# Altium project mb1191.PrjPCB (part 1 of 3)
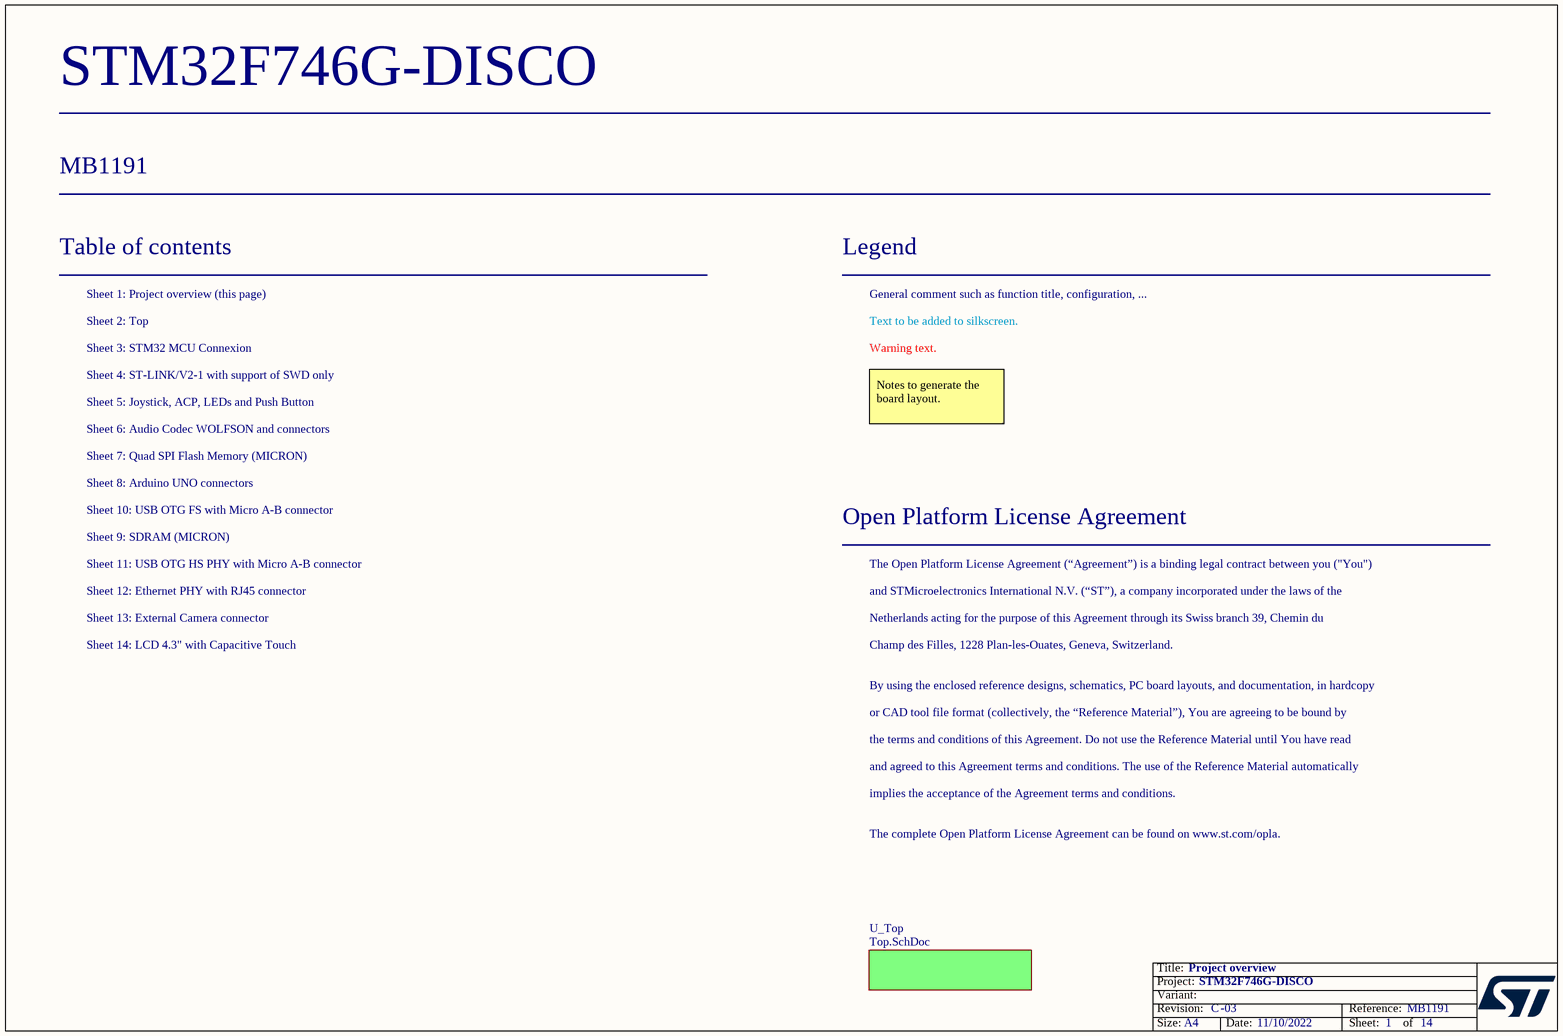
[diagram p0: Project_Overview.SchDoc]
Board_Reference: MB1191; Board_PCB_Revision: C; Board_Name: STM32F746G-DISCO; Board_Document_Date: 11/10/2022; Board_Assembly_Revision: 03
14 sheets, 358 parts. Net scope: flat (ports and power ports of the same name join across sheets).
Board file: MB1191.PcbDoc
Sheets:
  Project_Overview.SchDoc
    U_Top = Top.SchDoc
      U_ST_LINK_V2-1 = ST_LINK_V2-1.SCHDOC
      U_AUDIO = AUDIO.SchDoc
      U_USB_OTG_FS = USB_OTG_FS.SchDoc
      U_Peripherals = Peripherals.SchDoc
      U_QSPI = QSPI.SchDoc
      U_LCD-43 = LCD-43.SchDoc
      U_Arduino_ Connectors = Arduino_ Connectors.SchDoc
      U_SDRAM = SDRAM.SchDoc
      U_USB_OTG_HS = USB_OTG_HS.SchDoc
      U_STM32F7 = STM32F7.SchDoc
      U_Ethernet = Ethernet.SchDoc
      Camera-Connectors = Camera-Connectors.SchDoc

## Sheet Project_Overview.SchDoc: Project overview
size A4; Date: Not used; ApprovedBy: Not used; CheckedBy: Not used; Author: Not used; CompanyName: STMicroelectronics; DrawnBy: Not used; Engineer: Not used; Organization: Not used; Address1: Not used; Address2: Not used; Address3: Not used; Address4: Not used; DocumentNumber: MB1191; Revision: Not used; SheetNumber: 1; SheetTotal: 14; CurrentTime: Not used; CurrentDate: Not used; Time: Not used; DocumentFullPathAndName: Not used; DocumentName: Not used; ModifiedDate: Not used; ImagePath: Not used; ProjectName: Not used; Application_BuildNumber: Not used

### Sub-sheets
U_Top = Top.SchDoc: no entries

### Notes on the sheet
- Table of contents
- Sheet 1: Project overview (this page)
- Legend
- General comment such as function title, configuration, ...
- Sheet 2: Top
- Sheet 4: ST-LINK/V2-1 with support of SWD only
- Sheet 3: STM32 MCU Connexion
- Text to be added to silkscreen.
- Warning text.
- Sheet 5: Joystick, ACP, LEDs and Push Button
- Sheet 6: Audio Codec WOLFSON and connectors
- Notes to generate the board layout.
- Sheet 8: Arduino UNO connectors
- Sheet 10: USB OTG FS with Micro A-B connector
- Sheet 7: Quad SPI Flash Memory (MICRON)
- Sheet 9: SDRAM (MICRON)
- Sheet 11: USB OTG HS PHY with Micro A-B connector
- Open Platform License Agreement
- The Open Platform License Agreement (“Agreement”) is a binding legal contract between you ("You")
- Sheet 12: Ethernet PHY with RJ45 connector
- Sheet 13: External Camera connector
- Sheet 14: LCD 4.3" with Capacitive Touch
- and STMicroelectronics International N.V. (“ST”), a company incorporated under the laws of the
- Netherlands acting for the purpose of this Agreement through its Swiss branch 39, Chemin du
- Champ des Filles, 1228 Plan-les-Ouates, Geneva, Switzerland.
- By using the enclosed reference designs, schematics, PC board layouts, and documentation, in hardcopy
- or CAD tool file format (collectively, the “Reference Material”), You are agreeing to be bound by
- the terms and conditions of this Agreement. Do not use the Reference Material until You have read
- and agreed to this Agreement terms and conditions. The use of the Reference Material automatically
- implies the acceptance of the Agreement terms and conditions.
- The complete Open Platform License Agreement can be found on www.st.com/opla.
- Title:
- Project:
- Size:
- Revision:
- Variant:
- A4
- -
- Date:
- Reference:
- Sheet:
- of

## Sheet Top.SchDoc: STM32F7 Discovery Interconnexion
size A4; Date: 25-FEB-2015; Author: A.B; CompanyName: STMicroelectronics; Address1: 12, Rue Jules HOROWITZ; Address2: 38019 Grenoble; Address3: FRANCE; DocumentNumber: MB1191; Revision: B-02; SheetNumber: 2; SheetTotal: 14; Project: STM32F746G-DISCO
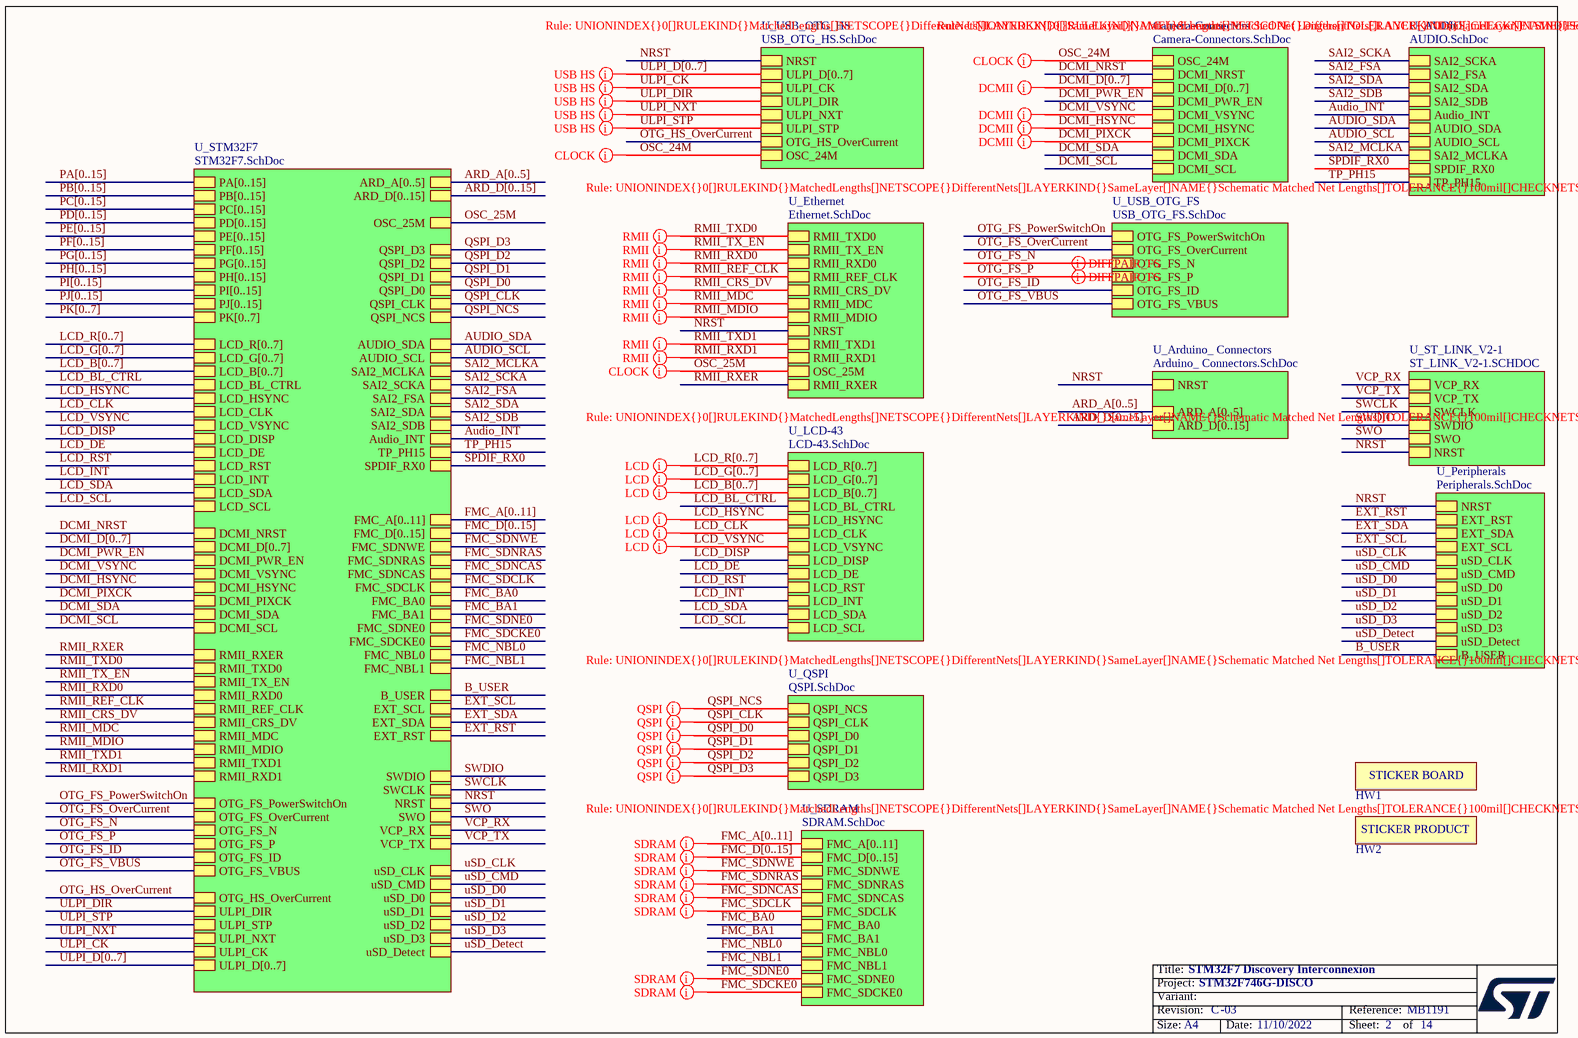
[diagram p1: Top.SchDoc]

### Parts
HW1  STICKER_BOARD  (value not drawn)  (no BOM)
HW2  STICKER_PRODUCT  (value not drawn)  (no BOM)

### Sub-sheets
Camera-Connectors = Camera-Connectors.SchDoc: OSC_24M, DCMI_NRST, DCMI_D[0..7], DCMI_PWR_EN, DCMI_VSYNC, DCMI_HSYNC, DCMI_PIXCK, DCMI_SDA, DCMI_SCL
U_Arduino_ Connectors = Arduino_ Connectors.SchDoc: NRST, ARD_A[0..5], ARD_D[0..15]
U_AUDIO = AUDIO.SchDoc: AUDIO_SDA, AUDIO_SCL, SAI2_MCLKA, SPDIF_RX0, TP_PH15, SAI2_SCKA, SAI2_FSA, SAI2_SDA, SAI2_SDB, Audio_INT
U_Ethernet = Ethernet.SchDoc: RMII_TXD0, RMII_TX_EN, RMII_RXD0, RMII_REF_CLK, RMII_CRS_DV, RMII_MDC, RMII_MDIO, NRST, RMII_TXD1, RMII_RXD1, OSC_25M, RMII_RXER
U_LCD-43 = LCD-43.SchDoc: LCD_R[0..7], LCD_BL_CTRL, LCD_B[0..7], LCD_G[0..7], LCD_HSYNC, LCD_CLK, LCD_VSYNC, LCD_DISP, LCD_DE, LCD_RST, LCD_INT, LCD_SDA, LCD_SCL
U_Peripherals = Peripherals.SchDoc: NRST, EXT_RST, EXT_SCL, EXT_SDA, uSD_CLK, uSD_CMD, uSD_D0, uSD_D1, uSD_D2, uSD_D3, uSD_Detect, B_USER
U_QSPI = QSPI.SchDoc: QSPI_D0, QSPI_D3, QSPI_D1, QSPI_CLK, QSPI_NCS, QSPI_D2
U_SDRAM = SDRAM.SchDoc: FMC_A[0..11], FMC_D[0..15], FMC_SDNWE, FMC_SDNRAS, FMC_SDNCAS, FMC_SDCLK, FMC_BA0, FMC_BA1, FMC_NBL0, FMC_NBL1, FMC_SDNE0, FMC_SDCKE0
U_ST_LINK_V2-1 = ST_LINK_V2-1.SCHDOC: SWDIO, SWCLK, NRST, VCP_RX, VCP_TX, SWO
U_STM32F7 = STM32F7.SchDoc: PA[0..15], PB[0..15], PC[0..15], PD[0..15], PE[0..15], PF[0..15], PG[0..15], PH[0..15], PI[0..15], PJ[0..15], PK[0..7], OSC_25M, LCD_R[0..7], LCD_BL_CTRL, LCD_B[0..7], LCD_G[0..7], LCD_HSYNC, LCD_CLK, LCD_VSYNC, LCD_DISP, LCD_DE, LCD_RST, LCD_INT, LCD_SDA, LCD_SCL, DCMI_NRST, DCMI_D[0..7], DCMI_PWR_EN, DCMI_VSYNC, DCMI_HSYNC, DCMI_PIXCK, DCMI_SDA, DCMI_SCL, RMII_TXD0, RMII_TX_EN, RMII_RXD0, RMII_REF_CLK, RMII_CRS_DV, RMII_MDC, RMII_MDIO, RMII_TXD1, RMII_RXD1, ULPI_D[0..7], ULPI_CK, ULPI_DIR, ULPI_NXT, ULPI_STP, OTG_FS_N, OTG_FS_P, OTG_FS_ID, OTG_FS_VBUS, OTG_FS_PowerSwitchOn, OTG_FS_OverCurrent, QSPI_D0, QSPI_D3, QSPI_D1, QSPI_CLK, QSPI_NCS, AUDIO_SDA, AUDIO_SCL, SAI2_MCLKA, EXT_SCL, EXT_SDA, EXT_RST, uSD_CLK, uSD_CMD, uSD_D0, uSD_D1, uSD_D2, uSD_D3, uSD_Detect, SWDIO, SWCLK, NRST, SWO, VCP_RX, VCP_TX, FMC_A[0..11], FMC_D[0..15], FMC_SDNWE, FMC_SDNRAS, FMC_SDNCAS, FMC_SDCLK, FMC_BA0, FMC_BA1, FMC_SDNE0, FMC_SDCKE0, FMC_NBL0, FMC_NBL1, SPDIF_RX0, QSPI_D2, B_USER, ARD_A[0..5], ARD_D[0..15], RMII_RXER, OTG_HS_OverCurrent, SAI2_SCKA, SAI2_FSA, SAI2_SDA, SAI2_SDB, Audio_INT, TP_PH15
U_USB_OTG_FS = USB_OTG_FS.SchDoc: OTG_FS_PowerSwitchOn, OTG_FS_OverCurrent, OTG_FS_N, OTG_FS_P, OTG_FS_ID, OTG_FS_VBUS
U_USB_OTG_HS = USB_OTG_HS.SchDoc: ULPI_D[0..7], ULPI_CK, ULPI_DIR, ULPI_NXT, ULPI_STP, OSC_24M, NRST, OTG_HS_OverCurrent

### Nets
Audio_INT: sheet U_AUDIO/Audio_INT, sheet U_STM32F7/Audio_INT
AUDIO_SCL: sheet U_AUDIO/AUDIO_SCL, sheet U_STM32F7/AUDIO_SCL
AUDIO_SDA: sheet U_AUDIO/AUDIO_SDA, sheet U_STM32F7/AUDIO_SDA
B_USER: sheet U_Peripherals/B_USER, sheet U_STM32F7/B_USER
DCMI_HSYNC: sheet U_STM32F7/DCMI_HSYNC, sheet Camera-Connectors/DCMI_HSYNC
DCMI_NRST: sheet U_STM32F7/DCMI_NRST, sheet Camera-Connectors/DCMI_NRST
DCMI_PIXCK: sheet U_STM32F7/DCMI_PIXCK, sheet Camera-Connectors/DCMI_PIXCK
DCMI_PWR_EN: sheet U_STM32F7/DCMI_PWR_EN, sheet Camera-Connectors/DCMI_PWR_EN
DCMI_SCL: sheet U_STM32F7/DCMI_SCL, sheet Camera-Connectors/DCMI_SCL
DCMI_SDA: sheet U_STM32F7/DCMI_SDA, sheet Camera-Connectors/DCMI_SDA
DCMI_VSYNC: sheet U_STM32F7/DCMI_VSYNC, sheet Camera-Connectors/DCMI_VSYNC
EXT_RST: sheet U_Peripherals/EXT_RST, sheet U_STM32F7/EXT_RST
EXT_SCL: sheet U_Peripherals/EXT_SCL, sheet U_STM32F7/EXT_SCL
EXT_SDA: sheet U_Peripherals/EXT_SDA, sheet U_STM32F7/EXT_SDA
FMC_BA0: sheet U_SDRAM/FMC_BA0, sheet U_STM32F7/FMC_BA0
FMC_BA1: sheet U_SDRAM/FMC_BA1, sheet U_STM32F7/FMC_BA1
FMC_NBL0: sheet U_SDRAM/FMC_NBL0, sheet U_STM32F7/FMC_NBL0
FMC_NBL1: sheet U_SDRAM/FMC_NBL1, sheet U_STM32F7/FMC_NBL1
FMC_SDCKE0: sheet U_SDRAM/FMC_SDCKE0, sheet U_STM32F7/FMC_SDCKE0
FMC_SDCLK: sheet U_SDRAM/FMC_SDCLK, sheet U_STM32F7/FMC_SDCLK
FMC_SDNCAS: sheet U_SDRAM/FMC_SDNCAS, sheet U_STM32F7/FMC_SDNCAS
FMC_SDNE0: sheet U_SDRAM/FMC_SDNE0, sheet U_STM32F7/FMC_SDNE0
FMC_SDNRAS: sheet U_SDRAM/FMC_SDNRAS, sheet U_STM32F7/FMC_SDNRAS
FMC_SDNWE: sheet U_SDRAM/FMC_SDNWE, sheet U_STM32F7/FMC_SDNWE
LCD_BL_CTRL: sheet U_LCD-43/LCD_BL_CTRL, sheet U_STM32F7/LCD_BL_CTRL
LCD_CLK: sheet U_LCD-43/LCD_CLK, sheet U_STM32F7/LCD_CLK
LCD_DE: sheet U_LCD-43/LCD_DE, sheet U_STM32F7/LCD_DE
LCD_DISP: sheet U_LCD-43/LCD_DISP, sheet U_STM32F7/LCD_DISP
LCD_HSYNC: sheet U_LCD-43/LCD_HSYNC, sheet U_STM32F7/LCD_HSYNC
LCD_INT: sheet U_LCD-43/LCD_INT, sheet U_STM32F7/LCD_INT
LCD_RST: sheet U_LCD-43/LCD_RST, sheet U_STM32F7/LCD_RST
LCD_SCL: sheet U_LCD-43/LCD_SCL, sheet U_STM32F7/LCD_SCL
LCD_SDA: sheet U_LCD-43/LCD_SDA, sheet U_STM32F7/LCD_SDA
LCD_VSYNC: sheet U_LCD-43/LCD_VSYNC, sheet U_STM32F7/LCD_VSYNC
NRST: sheet U_ST_LINK_V2-1/NRST, sheet U_Peripherals/NRST, sheet U_Arduino_ Connectors/NRST, sheet U_USB_OTG_HS/NRST, sheet U_STM32F7/NRST, sheet U_Ethernet/NRST
OSC_24M: sheet U_USB_OTG_HS/OSC_24M, sheet Camera-Connectors/OSC_24M
OSC_25M: sheet U_STM32F7/OSC_25M, sheet U_Ethernet/OSC_25M
OTG_FS_ID: sheet U_USB_OTG_FS/OTG_FS_ID, sheet U_STM32F7/OTG_FS_ID
OTG_FS_N: sheet U_USB_OTG_FS/OTG_FS_N, sheet U_STM32F7/OTG_FS_N
OTG_FS_OverCurrent: sheet U_USB_OTG_FS/OTG_FS_OverCurrent, sheet U_STM32F7/OTG_FS_OverCurrent
OTG_FS_P: sheet U_USB_OTG_FS/OTG_FS_P, sheet U_STM32F7/OTG_FS_P
OTG_FS_PowerSwitchOn: sheet U_USB_OTG_FS/OTG_FS_PowerSwitchOn, sheet U_STM32F7/OTG_FS_PowerSwitchOn
OTG_FS_VBUS: sheet U_USB_OTG_FS/OTG_FS_VBUS, sheet U_STM32F7/OTG_FS_VBUS
OTG_HS_OverCurrent: sheet U_USB_OTG_HS/OTG_HS_OverCurrent, sheet U_STM32F7/OTG_HS_OverCurrent
QSPI_CLK: sheet U_QSPI/QSPI_CLK, sheet U_STM32F7/QSPI_CLK
QSPI_D0: sheet U_QSPI/QSPI_D0, sheet U_STM32F7/QSPI_D0
QSPI_D1: sheet U_QSPI/QSPI_D1, sheet U_STM32F7/QSPI_D1
QSPI_D2: sheet U_QSPI/QSPI_D2, sheet U_STM32F7/QSPI_D2
QSPI_D3: sheet U_QSPI/QSPI_D3, sheet U_STM32F7/QSPI_D3
QSPI_NCS: sheet U_QSPI/QSPI_NCS, sheet U_STM32F7/QSPI_NCS
RMII_CRS_DV: sheet U_STM32F7/RMII_CRS_DV, sheet U_Ethernet/RMII_CRS_DV
RMII_MDC: sheet U_STM32F7/RMII_MDC, sheet U_Ethernet/RMII_MDC
RMII_MDIO: sheet U_STM32F7/RMII_MDIO, sheet U_Ethernet/RMII_MDIO
RMII_REF_CLK: sheet U_STM32F7/RMII_REF_CLK, sheet U_Ethernet/RMII_REF_CLK
RMII_RXD0: sheet U_STM32F7/RMII_RXD0, sheet U_Ethernet/RMII_RXD0
RMII_RXD1: sheet U_STM32F7/RMII_RXD1, sheet U_Ethernet/RMII_RXD1
RMII_RXER: sheet U_STM32F7/RMII_RXER, sheet U_Ethernet/RMII_RXER
RMII_TX_EN: sheet U_STM32F7/RMII_TX_EN, sheet U_Ethernet/RMII_TX_EN
RMII_TXD0: sheet U_STM32F7/RMII_TXD0, sheet U_Ethernet/RMII_TXD0
RMII_TXD1: sheet U_STM32F7/RMII_TXD1, sheet U_Ethernet/RMII_TXD1
SAI2_FSA: sheet U_AUDIO/SAI2_FSA, sheet U_STM32F7/SAI2_FSA
SAI2_MCLKA: sheet U_AUDIO/SAI2_MCLKA, sheet U_STM32F7/SAI2_MCLKA
SAI2_SCKA: sheet U_AUDIO/SAI2_SCKA, sheet U_STM32F7/SAI2_SCKA
SAI2_SDA: sheet U_AUDIO/SAI2_SDA, sheet U_STM32F7/SAI2_SDA
SAI2_SDB: sheet U_AUDIO/SAI2_SDB, sheet U_STM32F7/SAI2_SDB
SPDIF_RX0: sheet U_AUDIO/SPDIF_RX0, sheet U_STM32F7/SPDIF_RX0
SWCLK: sheet U_ST_LINK_V2-1/SWCLK, sheet U_STM32F7/SWCLK
SWDIO: sheet U_ST_LINK_V2-1/SWDIO, sheet U_STM32F7/SWDIO
SWO: sheet U_ST_LINK_V2-1/SWO, sheet U_STM32F7/SWO
TP_PH15: sheet U_AUDIO/TP_PH15, sheet U_STM32F7/TP_PH15
ULPI_CK: sheet U_USB_OTG_HS/ULPI_CK, sheet U_STM32F7/ULPI_CK
ULPI_DIR: sheet U_USB_OTG_HS/ULPI_DIR, sheet U_STM32F7/ULPI_DIR
ULPI_NXT: sheet U_USB_OTG_HS/ULPI_NXT, sheet U_STM32F7/ULPI_NXT
ULPI_STP: sheet U_USB_OTG_HS/ULPI_STP, sheet U_STM32F7/ULPI_STP
uSD_CLK: sheet U_Peripherals/uSD_CLK, sheet U_STM32F7/uSD_CLK
uSD_CMD: sheet U_Peripherals/uSD_CMD, sheet U_STM32F7/uSD_CMD
uSD_D0: sheet U_Peripherals/uSD_D0, sheet U_STM32F7/uSD_D0
uSD_D1: sheet U_Peripherals/uSD_D1, sheet U_STM32F7/uSD_D1
uSD_D2: sheet U_Peripherals/uSD_D2, sheet U_STM32F7/uSD_D2
uSD_D3: sheet U_Peripherals/uSD_D3, sheet U_STM32F7/uSD_D3
uSD_Detect: sheet U_Peripherals/uSD_Detect, sheet U_STM32F7/uSD_Detect
VCP_RX: sheet U_ST_LINK_V2-1/VCP_RX, sheet U_STM32F7/VCP_RX
VCP_TX: sheet U_ST_LINK_V2-1/VCP_TX, sheet U_STM32F7/VCP_TX

### Buses and harness runs
bus ARD_A[0..5] = sheet U_Arduino_ Connectors/ARD_A[0..5]
bus ARD_A[0..5] = sheet U_STM32F7/ARD_A[0..5]
bus ARD_D[0..15] = sheet U_Arduino_ Connectors/ARD_D[0..15]
bus ARD_D[0..15] = sheet U_STM32F7/ARD_D[0..15]
bus DCMI_D[0..7] = sheet Camera-Connectors/DCMI_D[0..7]
bus DCMI_D[0..7] = sheet U_STM32F7/DCMI_D[0..7]
bus FMC_A[0..11] = sheet U_SDRAM/FMC_A[0..11]
bus FMC_A[0..11] = sheet U_STM32F7/FMC_A[0..11]
bus FMC_D[0..15] = sheet U_SDRAM/FMC_D[0..15]
bus FMC_D[0..15] = sheet U_STM32F7/FMC_D[0..15]
bus LCD_B[0..7] = sheet U_LCD-43/LCD_B[0..7]
bus LCD_B[0..7] = sheet U_STM32F7/LCD_B[0..7]
bus LCD_G[0..7] = sheet U_LCD-43/LCD_G[0..7]
bus LCD_G[0..7] = sheet U_STM32F7/LCD_G[0..7]
bus LCD_R[0..7] = sheet U_LCD-43/LCD_R[0..7]
bus LCD_R[0..7] = sheet U_STM32F7/LCD_R[0..7]
bus PA[0..15] = sheet U_STM32F7/PA[0..15]
bus PB[0..15] = sheet U_STM32F7/PB[0..15]
bus PC[0..15] = sheet U_STM32F7/PC[0..15]
bus PD[0..15] = sheet U_STM32F7/PD[0..15]
bus PE[0..15] = sheet U_STM32F7/PE[0..15]
bus PF[0..15] = sheet U_STM32F7/PF[0..15]
bus PG[0..15] = sheet U_STM32F7/PG[0..15]
bus PH[0..15] = sheet U_STM32F7/PH[0..15]
bus PI[0..15] = sheet U_STM32F7/PI[0..15]
bus PJ[0..15] = sheet U_STM32F7/PJ[0..15]
bus PK[0..7] = sheet U_STM32F7/PK[0..7]
bus ULPI_D[0..7] = sheet U_STM32F7/ULPI_D[0..7]
bus ULPI_D[0..7] = sheet U_USB_OTG_HS/ULPI_D[0..7]

### Layout directives
rule Matched Net Lengths [Tolerance = 100mil]: (no net found under the mark), DCMI_HSYNC, DCMI_PIXCK, DCMI_VSYNC, FMC_SDCKE0, FMC_SDCLK, FMC_SDNCAS, FMC_SDNE0, FMC_SDNRAS, FMC_SDNWE, LCD_CLK, LCD_HSYNC, LCD_VSYNC, QSPI_CLK, QSPI_D0, QSPI_D1, QSPI_D2, QSPI_D3, QSPI_NCS, RMII_CRS_DV, RMII_MDC, RMII_MDIO, RMII_REF_CLK, RMII_RXD0, RMII_RXD1, RMII_TX_EN, RMII_TXD0, RMII_TXD1, ULPI_CK, ULPI_DIR, ULPI_NXT, ULPI_STP
rule Undefined: OSC_24M, OSC_25M
differential pair: OTG_FS_N, OTG_FS_P

### Notes on the sheet
- Title:
- Project:
- Size:
- Revision:
- Variant:
- A4
- -
- Date:
- Reference:
- Sheet:
- of
- (in symbol STICKER_BOARD) STICKER BOARD
- (in symbol STICKER_PRODUCT) STICKER PRODUCT

## Sheet ST_LINK_V2-1.SCHDOC: ST-LINK/V2-1 with support of SWD only
size A4; Date: 25-FEB-2015; Author: A.B; CompanyName: STMicroelectronics; Address1: 12, Rue Jules HOROWITZ; Address2: 38019 Grenoble; Address3: FRANCE; DocumentNumber: MB1191; Revision: B-02; SheetNumber: 4; SheetTotal: 14; Project: STM32F746G-DISCO
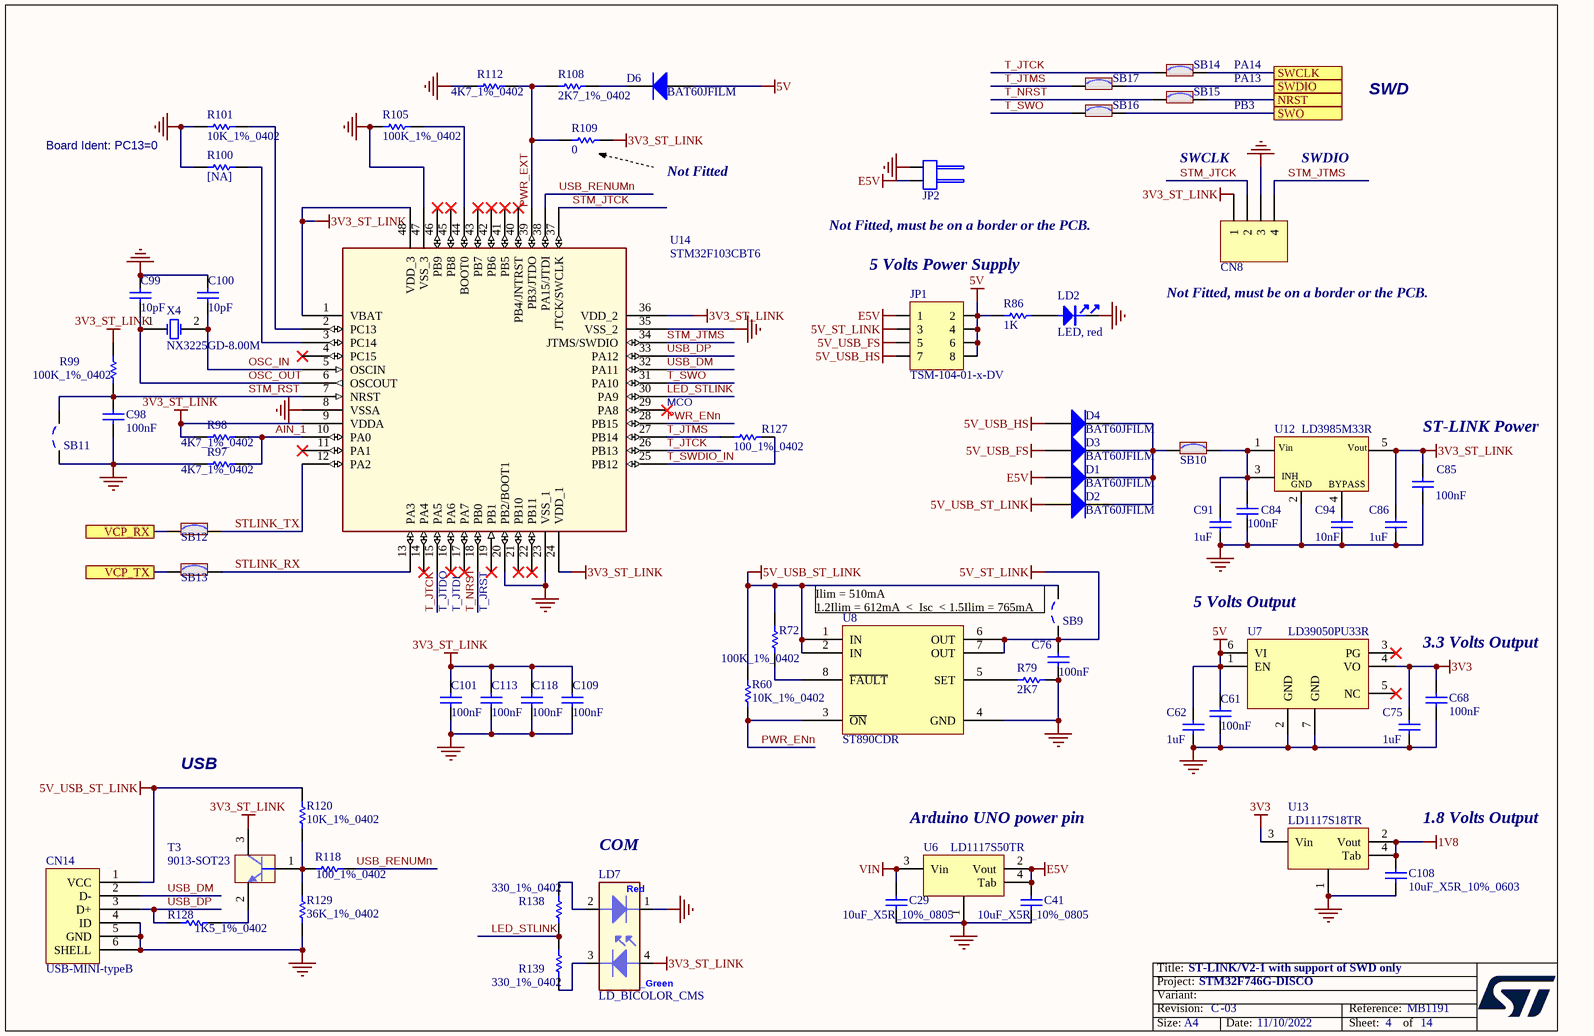
[diagram p2: ST_LINK_V2-1.SCHDOC]

### Parts
C29  10uF_X5R_10%_0805  [0805C]
C41  10uF_X5R_10%_0805  [0805C]
C61  100nF  [0402C]
C62  1uF  [0603C]
C68  100nF  [0402C]
C75  1uF  [0603C]
C76  100nF  [0402C]
C84  100nF  [0402C]
C85  100nF  [0402C]
C86  1uF  [0603C]
C91  1uF  [0603C]
C94  10nF  [0603C]
C98  100nF  [0402C]
C99  10pF  [0402C]
C100  10pF  [0402C]
C101  100nF  [0402C]
C108  10uF_X5R_10%_0603  [0603C]
C109  100nF  [0402C]
C113  100nF  [0402C]
C118  100nF  [0402C]
CN8  Header 4  [Header 4]  (value not drawn)
CN14  USB-MINI-typeB  [USB-MINI-B-SMD]
D1  BAT60JFILM  [SOD323/A]
D2  BAT60JFILM  [SOD323/A]
D3  BAT60JFILM  [SOD323/A]
D4  BAT60JFILM  [SOD323/A]
D6  BAT60JFILM  [SOD323/A]
JP1  TSM-104-01-x-DV  [TSM-104-01-x-DV]
JP2  TSM-102-01-F-SH-A  [TSM-102-01-F-SH-A]  (value not drawn)
LD2  LED, red  [0603D]
LD7  LD_BICOLOR_CMS  [HSMF-A201]
R60  10K_1%_0402  [0402R]
R72  100K_1%_0402  [0402R]
R79  2K7  [0402R]
R86  1K  [0402R]
R97  4K7_1%_0402  [0402R]
R98  4K7_1%_0402  [0402R]
R99  100K_1%_0402  [0402R]
R100  [NA]  [0402R]
R101  10K_1%_0402  [0402R]
R105  100K_1%_0402  [0402R]
R108  2K7_1%_0402  [0402R]
R109  0  [0402R]
R112  4K7_1%_0402  [0402R]
R118  100_1%_0402  [0402R]
R120  10K_1%_0402  [0402R]
R127  100_1%_0402  [0402R]
R128  1K5_1%_0402  [0402R]
R129  36K_1%_0402  [0402R]
R138  330_1%_0402  [0402R]
R139  330_1%_0402  [0402R]
SB9  Solder Bridge OFF  [JP2_SMD]  (value not drawn)
SB10  Solder Bridge ON  [JP2_SMD]  (value not drawn)
SB11  Solder Bridge OFF  [JP2_SMD]  (value not drawn)
SB12  Solder Bridge ON  [JP2_SMD]  (value not drawn)
SB13  Solder Bridge ON  [JP2_SMD]  (value not drawn)
SB14  Solder Bridge ON  [JP2_SMD]  (value not drawn)
SB15  Solder Bridge ON  [JP2_SMD]  (value not drawn)
SB16  Solder Bridge ON  [JP2_SMD]  (value not drawn)
SB17  Solder Bridge ON  [JP2_SMD]  (value not drawn)
T3  9013-SOT23  [SOT23]
U6  LD1117S50TR  [SOT-223]
U7  LD39050PU33R  [DFN6_3x3]
U8  ST890CDR  [SO-8]
U12  LD3985M33R  [SOT23-5L]
U13  LD1117S18TR  [SOT-223]
U14  STM32F103CBT6  [QFP48 7x7]
X4  NX3225GD-8.00M  [XTAL_2SM_3R2X2R5]

### Ports
NRST, SWCLK, SWDIO, SWO, VCP_RX, VCP_TX

### Nets
1V8: C108.2 U13.2(Vout) U13.4(Tab)
3V3: C68.2 C75.2 U7.4(VO) U13.3(Vin)
3V3_ST_LINK: C85.2 C86.1 C101.2 C109.2 C113.2 C118.1 CN8.1 LD7.4 R98.1 R99.2 R109.2 T3.3(C) U12.5(Vout) U14.1(VBAT) U14.9(VDDA) U14.24(VDD_1) U14.36(VDD_2) U14.48(VDD_3)
5V: C61.2 C62.2 D6.1(A) JP1.2 JP1.4 JP1.6 JP1.8 R86.1 U7.1(EN) U7.6(VI)
5V_ST_LINK: C76.2 JP1.3 SB9.1 U8.6(OUT) U8.7(OUT)
5V_USB_FS: D3.1(A) JP1.5
5V_USB_HS: D4.1(A) JP1.7
5V_USB_ST_LINK: CN14.1(VCC) D2.1(A) R60.2 R72.2 R120.2 SB9.2 U8.1(IN) U8.2(IN)
E5V: C41.2 D1.1(A) JP1.1 JP2.2(NO) U6.2(Vout) U6.4(Tab)
GND: C29.1 C41.1 C61.1 C62.1 C68.1 C75.1 C76.1 C84.1 C85.1 C86.2 C91.1 C94.1 C98.1 C99.1 C100.1 C101.1 C108.1 C109.1 C113.1 C118.2 CN8.3 CN14.4(ID) CN14.5(GND) CN14.6(SHELL) JP2.1(COMMON) LD2.2 LD7.1 R79.2 R97.1 R100.1 R101.1 R105.1 R112.1 R129.1 SB11.1 U6.1 U7.2(GND) U7.7(GND) U8.4(GND) U12.2(GND) U13.1 U14.8(VSSA) U14.20(PB2/BOOT1) U14.23(VSS_1) U14.35(VSS_2) U14.47(VSS_3)
VIN: C29.2 U6.3(Vin)
AIN_1: R97.2 R98.2 U14.10(PA0)
DCMI_NRST: SB15.2 ; port NRST
LED_STLINK: R138.1 R139.2 U14.30(PA9)
OSC_IN: C100.2 U14.5(OSCIN) X4.2(OSC2)
OSC_OUT: C99.2 U14.6(OSCOUT) X4.1(OSC1)
PA13: SB17.2 ; port SWDIO
PA14: SB14.2 ; port SWCLK
PB3: SB16.2 ; port SWO
PB7: SB12.1 ; port VCP_RX
PWR_ENn: R60.1 U8.3(~{ON}) U14.28(PB15)
PWR_EXT: R108.1 R109.1 R112.2 U14.39(PB3/JTDO)
STLINK_RX: SB13.2 U14.13(PA3)
STLINK_TX: SB12.2 U14.12(PA2)
STM_JTCK: CN8.2 U14.37(JTCK/SWCLK)
STM_JTMS: CN8.4 U14.34(JTMS/SWDIO)
STM_RST: C98.2 R99.1 SB11.2 U14.7(NRST)
T_JTCK: SB14.1 U14.15(PA5) U14.26(PB13)
T_JTMS: R127.1 SB17.1 U14.27(PB14)
T_NRST: SB15.1 U14.18(PB0)
T_SWDIO_IN: R127.2 U14.25(PB12)
T_SWO: SB16.1 U14.31(PA10)
USB_DM: CN14.2(D-) U14.32(PA11)
USB_DP: CN14.3(D+) R128.1 U14.33(PA12)
USB_RENUMn: R118.2 U14.38(PA15/JTDI)
VCP_TX: SB13.1 ; port VCP_TX
NetC84_2: C84.2 C91.2 SB10.2 U12.1(Vin) U12.3(CE)
NetC94_2: C94.2 U12.4(BYPASS)
NetD1_2: D1.2(K) D2.2(K) D3.2(K) D4.2(K) SB10.1
NetD6_2: D6.2(K) R108.2
NetLD2_1: LD2.1 R86.2
NetLD7_2: LD7.2 R138.2
NetLD7_3: LD7.3 R139.1
NetR72_1: R72.1 U8.8(~{FAULT})
NetR79_1: R79.1 U8.5(SET)
NetR100_2: R100.2 U14.3(PC14)
NetR101_2: R101.2 U14.2(PC13)
NetR105_2: R105.2 U14.44(BOOT0)
NetR118_1: R118.1 R120.1 R129.2 T3.1(B)
NetR128_2: R128.2 T3.2(E)

Not connected (* = marked no-connect by the designer): U7 3(PG)* 5(NC)*; U14 4(PC15)* 11(PA1)* 14(PA4)* 16(PA6)* 17(PA7)* 19(PB1)* 21(PB10)* 22(PB11)* 29(PA8)* 40(PB4/JNTRST)* 41(PB5)* 42(PB6)* 43(PB7)* 45(PB8)* 46(PB9)*

### Notes on the sheet
- PA14
- PA13
- PB3
- SWD
- Board Ident: PC13=0
- Not Fitted
- SWCLK
- SWDIO
- (near JP2) Not Fitted, must be on a border or the PCB.
- 5 Volts Power Supply
- Not Fitted, must be on a border or the PCB.
- MCO
- ST-LINK Power
- (near U14) T_JTDO
- (near U14) T_JTDI
- (near U14) T_JRST
- (near SB9) Ilim = 510mA
  1.2Ilim = 612mA  <  Isc  < 1.5Ilim = 765mA
- 5 Volts Output
- 3.3 Volts Output
- USB
- COM
- (near U6) Arduino UNO power pin
- 1.8 Volts Output
- Title:
- Project:
- Size:
- Revision:
- Variant:
- A4
- -
- Date:
- Reference:
- Sheet:
- of
- (in symbol LD3985M33R) INH
- (in symbol LD_BICOLOR_CMS) Red; _Green

### Library data of the parts
C29 C41 = Cap_10uF_X5R_10%_0805: Capacitor,10uF,25V,X5R,10%,0805,YAGEO; Manuf_Part_1: CC0805KRX5R8BB106; Revision: July-2002: Re-released for DXP Platform.; Value: 10uF; Order: CC0805KRX5R8BB106; Manuf_1: YAGEO; ECCN_US/EU: n/a
C61 C68 C76 C84 C85 C98 C101 C109 C113 C118 = Cap_100nF_X7R_10%_0402: Capacitor,100nF,16V,X7R,10%,0402,YAGEO; Manuf_Part_1: CC0402KRX7R7BB104; Revision: July-2002: Re-released for DXP Platform.; Value: 100nF; Order: CC0402KRX7R7BB104; Manuf_1: YAGEO
C62 C75 C86 C91 = Cap_1uF_X5R_10%_0603: Capacitor,1uF,16V,X5R,10%,0603,YAGEO; Manuf_Part_1: CC0603KRX5R7BB105; Revision: July-2002: Re-released for DXP Platform.; Value: 1uF; Order: CC0603KRX5R7BB105; Manuf_1: YAGEO
C94 = Cap_10nF_X7R_10%_0603: Capacitor,10nF,50V,X7R,10%,0603,YAGEO; Manuf_Part_1: CC0603KRX7R9BB103; Revision: July-2002: Re-released for DXP Platform.; Value: 10nF; Order: CC0603KRX7R9BB103; Manuf_1: YAGEO
C99 C100 = Cap_10pF_NPO_5%_0402: Capacitor,10pF,50V,NPO,5%,0402,YAGEO; Order: CC0402JRNPO9BN100; Revision: July-2002: Re-released for DXP Platform.; Value: 10pF; Manuf_1: YAGEO; Manuf_Part_1: CC0402JRNPO9BN100; ECCN_US/EU: n/a
C108 = Cap_10uF_X5R_10%_0603: Capacitor,10uF,6.3V,X5R,10%,0603,YAGEO; Manuf_Part_1: CC0603KRX5R5BB106; Revision: July-2002: Re-released for DXP Platform.; Value: 10uF; Order: CC0603KRX5R5BB106; Manuf_1: YAGEO; ECCN_US/EU: n/a
CN8 = Header 4: Header, 4-Pin; Fitted: NO; Revision: 17-Jul-2002: Re-released for DXP Platform.; Publisher: Altium Limited; ECCN_US/EU: n/a
CN14 = USB-MINI-typeB connector: Manuf_Part_1: 5075BMR-05-SM; Manuf_Part_2: 218205M1110T; Manuf_2: lyconn; Manuf_Part_3: MUSB5QS-BM1H6-NLB-E; Manuf_3: TOWNES; ECCN_US/EU: n/a
D1-D4 D6 = BAT60JFILM: Manuf_1: STM; Provided: ST; ECCN_US/EU: EAR99/NEC; Ref St: 9151097; Revision: July-2002: Re-released for DXP Platform.; Order: BAT60JFILM; Manuf_Part_1: BAT60JFILM; Distrib: ST
JP1 = Header_4X2_SMD: Header, 4-Pins, Double row Vertical, SMD, 2.54; Manuf_1: SAMTEC; Manuf_Part_1: TSM-104-01-x-DV; ECCN_US/EU: n/a
JP2 = JP2_CMS: Header, 2-Pins, Single row Horizontal SMD, 2.54; Manuf_1: SAMTEC; ECCN_US/EU: EAR99/NEC; Manuf_Part_1: TSM-102-01-F-SH-A
LD2 = LED_red: LED, red, 0603; Manuf_1: everlight; Manuf_Part_1: 19-217/R6C-AL1M2VY/3T; ECCN_US/EU: EAR99/NEC; Order: 19-217/R6C-AL1M2VY/3T
LD7 = LD_BICOLOR_CMS: Bicolor Led; Manuf_Part_1: HSMF-A201-A00J1; Manuf_1: Avago Technologies; Manuf_2: everluck; Manuf_Part_2: LE-RGW35280; Ref St: xxxxxx; ECCN_US/EU: EAR99/NEC; Distrib: RADIOSPARES
R60 R101 R120 = Res_10K_1%_0402: Resistor,10K,0402,1%,YAGEO; Manuf_Part_1: RC0402FR-0710KL; Value: 10K; Manuf_1: YAGEO; Order: RC0402FR-0710KL; ECCN_US/EU: n/a
R72 R99 R105 = Res_100K_1%_0402: Resistor,100K,0402,1%,YAGEO; Manuf_Part_1: RT0402FRE07100KL; Value: 100K; Manuf_1: YAGEO; Order: RT0402FRE07100KL; ECCN_US/EU: n/a
R79 R108 = Res_2K7_1%_0402: Resistor,2K7,0402,1%,YAGEO; Manuf_Part_1: RC0402FR-072K7L; Value: 2K7; Manuf_1: YAGEO; Order: RC0402FR-072K7L; ECCN_US/EU: n/a; Distrib: FARNELL
R86 = Res_1K_1%_0402: Resistor,1K,0402,1%,YAGEO; Manuf_Part_1: RC0402FR-071KL; Value: 1K; Manuf_1: YAGEO; Order: RC0402FR-071KL; ECCN_US/EU: n/a
R97 R98 R112 = Res_4K7_1%_0402: Resistor,4K7,0402,1%,YAGEO; Manuf_Part_1: RT0402FRE074K7L; Value: 4K7; Manuf_1: YAGEO; Order: RT0402FRE074K7L; ECCN_US/EU: n/a
R100 = Res_NA_0402: Resistor,[NA],0402; Fitted: NO; Value: [NA]; ECCN_US/EU: n/a
R109 = Res_0_5%_0402: Resistor,0,0402,5%,YAGEO; Manuf_Part_1: RC0402JR-070RL; Order: 2363467; Fitted: NO; Value: 0; ECCN_US/EU: n/a; Manuf_1: YAGEO; Distrib: FARNELL
R118 R127 = Res_100_1%_0402: Resistor,100,0402,1%,YAGEO; Manuf_Part_1: RC0402FR-07100RL; Value: 100; Order: 9239111; Manuf_1: YAGEO; ECCN_US/EU: n/a; Distrib: FARNELL
R128 = Res_1K5_1%_0402: Resistor,1K5,0402,1%,YAGEO; Manuf_Part_1: RC0402FR-071K5L; Value: 1K5; Manuf_1: YAGEO; Order: RC0402FR-071K5L; ECCN_US/EU: n/a; Distrib: FARNELL
R129 = Res_36K_1%_0402: Resistor,36K,0402,1%,YAGEO; Manuf_Part_1: RC0402FR-0736KL; Value: 36K; Manuf_1: YAGEO; Order: RC0402FR-0736KL; ECCN_US/EU: n/a; Distrib: FARNELL
R138 R139 = Res_330_1%_0402: Resistor,330,0402,1%,YAGEO; Manuf_Part_1: RC0402FR-07330RL; Value: 330; ECCN_US/EU: n/a; Manuf_1: YAGEO; Distrib: DIGIKEY; Order: RC0402FR-07330RL
SB9 SB11 = SB_OFF: Solder: NO; Revision: July-2002: Re-released for DXP Platform.; ECCN_US/EU: n/a
SB10 SB12-SB17 = SB_ON: Solder: YES; Revision: July-2002: Re-released for DXP Platform.; ECCN_US/EU: n/a
T3 = 9013-SOT23: NPN Bipolar Transistor; Manuf_1: NXP; Manuf_Part_1: BSR14; Order: 1081310; ECCN_US/EU: EAR99/NEC; Revision: July-2002: Re-released for DXP Platform.; Distrib: FARNELL
U6 = LD1117S50TR: IC REG LDO 5V 0.8A SOT223; Manuf_1: STM; Ordered by: ST; ECCN_US/EU: EAR99/NEC; Ref St: 9176133; Manuf_Part_1: LD1117S50TR; Distrib: ST; Order: LD1117S50TR; Provided: ST
U7 = LD39050P: Ultra low drop-low , 500 mA low quiescent current; Manuf_1: STM; Provided: ST; ECCN_US/EU: EAR99/NEC; Ref St: xxxxxxxx; Distrib: ST; Manuf_Part_1: LD39050PU33R; Order: LD39050PU33R
U8 = ST890CDR: 1.2 A current limited high-side power switch with thermal shutdown; Manuf_1: STM; ECCN_US/EU: EAR99/NEC; Provided: ST; Manuf_Part_1: ST890CDR; Distrib: ST
U12 = LD3985M33R: Ultra low drop-low noise BiCMOS voltage, regulators low ESR capacitors compatible; Manuf_1: STM; Provided: ST; Ref St: 9176161; ECCN_US/EU: EAR99/NEC; Manuf_Part_1: LD3985M33R; Distrib: ST; Order: LD3985M33R
U13 = LD1117S18TR: LOW DROP FIXED AND ADJUSTABLE POSITIVE VOLTAGE REGULATORS (1.8 Volts); Manuf_1: STM; Ref St: 9176180; ECCN_US/EU: EAR99/NEC; Provided: ST; Manuf_Part_1: LD1117S18TR; Order: LD1117S18TR; Distrib: ST
U14 = STM32F103CBT6: Medium-density performance line ARM-based 32-bit MCU with 128KB Flash; Manuf_1: STM; Ref St: xxxxxxxx; Provided: ST; ECCN_US/EU: 3A991A2/NEC; Footprint: QFP48 7X7; Manuf_Part_1: STM32F103CBT6; Order: STM32F103CBT6; Distrib: ST
X4 = XTAL_8M_NX3225GD: Crystal 8Mhz, 8pF, -+50PPM, SMD; Manuf_1: NDK; Manuf_Part_1: NX3225GD 8MHz EXS00A-CG04874; Manuf_Part_2: NX3225GD-8.000M-STD-CRA-3; ECCN_US/EU: EAR99/NEC; NDK Ref: X3127326; Ref St: 9157029; Provided: ST; Order: NX3225GD 8MHz EXS00A-CG04874

## Sheet AUDIO.SchDoc: Audio Codec WOLFSON and connectors
size A4; Date: 25-FEB-2015; Author: A.B; CompanyName: STMicroelectronics; Address1: 12, Rue Jules HOROWITZ; Address2: 38019 Grenoble; Address3: FRANCE; DocumentNumber: MB1191; Revision: B-02; SheetNumber: 6; SheetTotal: 14; Project: STM32F746G-DISCO
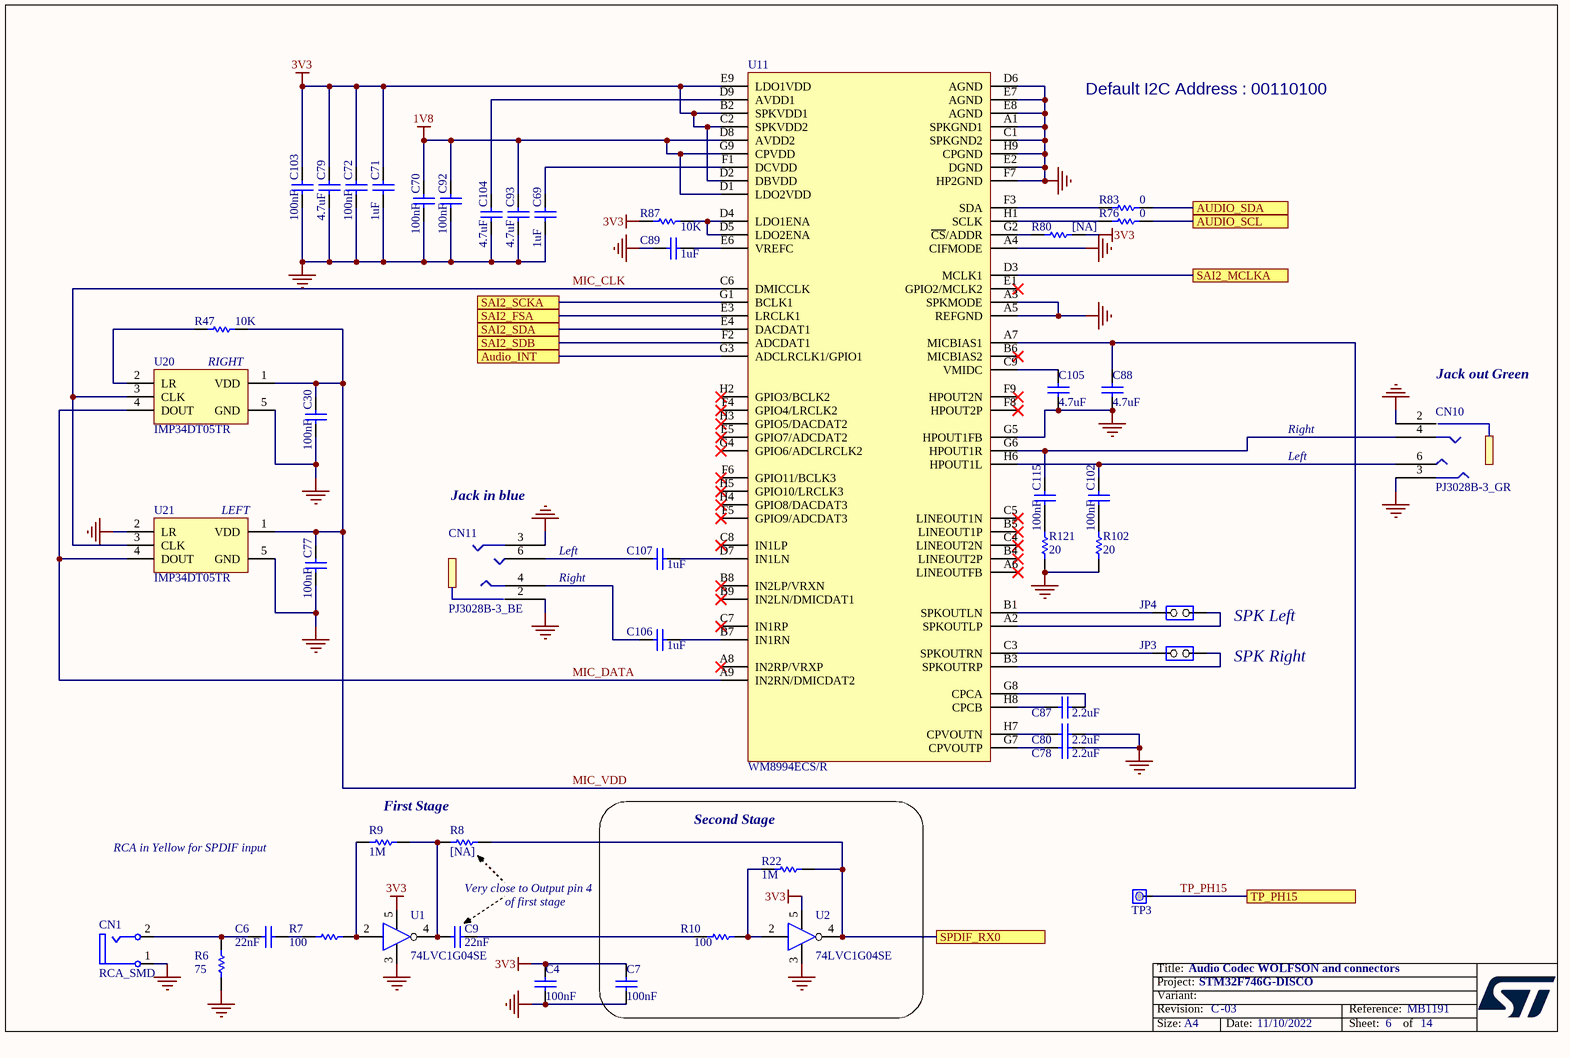
[diagram p3: AUDIO.SchDoc]

### Parts
C4  100nF  [0402C]
C6  22nF  [0402C]
C7  100nF  [0402C]
C9  22nF  [0402C]
C30  100nF  [0402C]
C69  1uF  [0603C]
C70  100nF  [0402C]
C71  1uF  [0603C]
C72  100nF  [0402C]
C77  100nF  [0402C]
C78  2.2uF  [0603C]
C79  4.7uF  [0603C]
C80  2.2uF  [0603C]
C87  2.2uF  [0603C]
C88  4.7uF  [0603C]
C89  1uF  [0603C]
C92  100nF  [0402C]
C93  4.7uF  [0603C]
C102  100nF  [0402C]
C103  100nF  [0402C]
C104  4.7uF  [0603C]
C105  4.7uF  [0603C]
C106  1uF  [0603C]
C107  1uF  [0603C]
C115  100nF  [0402C]
CN1  RCA_SMD  [RCA_SMD]
CN10  PJ3028B-3_GR  [PJ3028B]
CN11  PJ3028B-3_BE  [PJ3028B]
JP3  Jumper 2 pins  [SIP2/2.54]  (value not drawn)
JP4  Jumper 2 pins  [SIP2/2.54]  (value not drawn)
R6  75  [0402R]
R7  100  [0402R]
R8  [NA]  [0402R]
R9  1M  [0402R]
R10  100  [0402R]
R22  1M  [0402R]
R47  10K  [0402R]
R76  0  [0402R]
R80  [NA]  [0402R]
R83  0  [0402R]
R87  10K  [0402R]
R102  20  [0402R]
R121  20  [0402R]
TP3  Test point 1 pin with hole  [SIP1/2.54]  (value not drawn)
U1  74LVC1G04SE  [SOT353]
U2  74LVC1G04SE  [SOT353]
U11  WM8994ECS/R  [BGA72_0R5_4R5X4]
U20  IMP34DT05TR  [HCLGA_3X4X1_4LD]
U21  IMP34DT05TR  [HCLGA_3X4X1_4LD]

### Blocks framed on the sheet
Second Stage: C7 R10 R22 U2

### Ports
Audio_INT, AUDIO_SCL, AUDIO_SDA, SAI2_FSA, SAI2_MCLKA, SAI2_SCKA, SAI2_SDA, SAI2_SDB, SPDIF_RX0, TP_PH15

### Nets
1V8: C70.1 C92.1 C93.1 U11.D1(LDO2VDD) U11.D8(AVDD2) U11.G9(CPVDD)
3V3: C4.2 C7.2 C71.2 C72.1 C79.1 C103.1 R80.2 R87.2 U1.5(VCC) U2.5(VCC) U11.B2(SPKVDD1) U11.C2(SPKVDD2) U11.D2(DBVDD) U11.E9(LDO1VDD)
GND: C4.1 C7.1 C30.2 C69.1 C70.2 C71.1 C72.2 C77.2 C78.2 C79.2 C80.2 C88.1 C89.2 C92.2 C93.2 C103.2 C104.2 C105.1 CN1.1(Ground) CN10.2 CN10.3 CN11.2 CN11.3 R6.1 R102.2 R121.2 U1.3(GND) U2.3(GND) U11.A1(SPKGND1) U11.A3(SPKMODE) U11.A4(CIFMODE) U11.A5(REFGND) U11.C1(SPKGND2) U11.D6(AGND) U11.E2(DGND) U11.E7(AGND) U11.E8(AGND) U11.F7(HP2GND) U11.G5(HPOUT1FB) U11.H9(CPGND) U20.5(GND) U21.2(LR) U21.5(GND)
Audio_INT: U11.G3(ADCLRCLK1/GPIO1) ; port Audio_INT
AUDIO_SCL: R76.1 ; port AUDIO_SCL
AUDIO_SDA: R83.1 ; port AUDIO_SDA
MIC_CLK: U11.C6(DMICCLK) U20.3(CLK) U21.3(CLK)
MIC_DATA: U11.A9(IN2RN/DMICDAT2) U20.4(DOUT) U21.4(DOUT)
MIC_VDD: C30.1 C77.1 C88.2 R47.2 U11.A7(MICBIAS1) U20.1(VDD) U21.1(VDD)
PD7: R8.2 R22.2 U2.4(Y) ; port SPDIF_RX0
PG10: U11.F2(ADCDAT1) ; port SAI2_SDB
PI4: U11.D3(MCLK1) ; port SAI2_MCLKA
PI5: U11.G1(BCLK1) ; port SAI2_SCKA
PI6: U11.E4(DACDAT1) ; port SAI2_SDA
PI7: U11.E3(LRCLK1) ; port SAI2_FSA
TP_PH15: TP3.1(COMMON) ; port TP_PH15  [project net PH15]
NetC6_1: C6.1 CN1.2(Signal) R6.2
NetC6_2: C6.2 R7.1
NetC9_1: C9.1 R8.1 R9.2 U1.4(Y)
NetC9_2: C9.2 R10.1
NetC69_2: C69.2 U11.F1(DCVDD)
NetC78_1: C78.1 U11.G7(CPVOUTP)
NetC80_1: C80.1 U11.H7(CPVOUTN)
NetC87_1: C87.1 U11.H8(CPCB)
NetC87_2: C87.2 U11.G8(CPCA)
NetC89_1: C89.1 U11.E6(VREFC)
NetC102_1: C102.1 CN10.6 U11.H6(HPOUT1L)
NetC102_2: C102.2 R102.1
NetC104_1: C104.1 U11.D9(AVDD1)
NetC105_2: C105.2 U11.C9(VMIDC)
NetC106_1: C106.1 U11.B7(IN1RN)
NetC106_2: C106.2 CN11.4
NetC107_1: C107.1 U11.D7(IN1LN)
NetC107_2: C107.2 CN11.6
NetC115_1: C115.1 CN10.4 U11.G6(HPOUT1R)
NetC115_2: C115.2 R121.1
NetJP3_1: JP3.1(COMMON) U11.C3(SPKOUTRN)
NetJP3_2: JP3.2(NO) U11.B3(SPKOUTRP)
NetJP4_1: JP4.1(COMMON) U11.B1(SPKOUTLN)
NetJP4_2: JP4.2(NO) U11.A2(SPKOUTLP)
NetR7_2: R7.2 R9.1 U1.2(A)
NetR10_2: R10.2 R22.1 U2.2(A)
NetR47_1: R47.1 U20.2(LR)
NetR76_2: R76.2 U11.H1(SCLK)
NetR80_1: R80.1 U11.G2(~{CS}/ADDR)
NetR83_2: R83.2 U11.F3(SDA)
NetR87_1: R87.1 U11.D4(LDO1ENA) U11.D5(LDO2ENA)

Not connected (* = marked no-connect by the designer): U1 1(NC); U2 1(NC); U11 A6(LINEOUTFB)* A8(IN2RP/VRXP)* B4(LINEOUT2P)* B5(LINEOUT1P)* B6(MICBIAS2)* B8(IN2LP/VRXN)* B9(IN2LN/DMICDAT1)* C4(LINEOUT2N)* C5(LINEOUT1N)* C7(IN1RP)* C8(IN1LP)* E1(GPIO2/MCLK2)* E5(GPIO7/ADCDAT2)* F4(GPIO4/LRCLK2)* F5(GPIO9/ADCDAT3)* F6(GPIO11/BCLK3)* F8(HPOUT2P)* F9(HPOUT2N)* G4(GPIO6/ADCLRCLK2)* H2(GPIO3/BCLK2)* H3(GPIO5/DACDAT2)* H4(GPIO8/DACDAT3)* H5(GPIO10/LRCLK3)*

### Notes on the sheet
- Default I2C Address : 00110100
- (near U20) RIGHT
- (near CN10) Jack out Green
- Right
- (near U21) LEFT
- (near CN11) Jack in blue
- Left
- SPK Left
- SPK Right
- RCA in Yellow for SPDIF input
- First Stage
- Very close to Output pin 4
- of first stage
- Title:
- Project:
- Size:
- Revision:
- Variant:
- A4
- -
- Date:
- Reference:
- Sheet:
- of

### Library data of the parts
C4 C7 C30 C70 C72 C77 C92 C102 C103 C115 = Cap_100nF_X7R_10%_0402: as C61 on sheet ST_LINK_V2-1; Revision: July-2002: Re-released for DXP Platform.; Value: 100nF; Order: CC0402KRX7R7BB104; Manuf_1: YAGEO
  C30 C70 C72 C77 C92 C102 C103 C115: ECCN_US/EU: n/a
C6 C9 = Cap_22nF_X7R_10%_0402: Capacitor,22nF,16V,X7R,10%,0402,YAGEO; Manuf_Part_1: CC0402KRX7R7BB223; Revision: July-2002: Re-released for DXP Platform.; Value: 22nF; Order: CC0402KRX7R7BB223; Manuf_1: YAGEO; ECCN_US/EU: n/a
C69 C71 C89 C106 C107 = Cap_1uF_X5R_10%_0603: as C62 on sheet ST_LINK_V2-1; Revision: July-2002: Re-released for DXP Platform.; Value: 1uF; Order: CC0603KRX5R7BB105; Manuf_1: YAGEO; ECCN_US/EU: n/a
C78 C80 C87 = Cap_2.2uF_X5R_10%_0603: Capacitor,2.2uF,10V, X5R,10%,0603,YAGEO; Manuf_Part_1: CC0603KRX5R6BB225; Manuf_Part_2: C0603C225K8PACTU; Manuf_2: KEMET; Revision: July-2002: Re-released for DXP Platform.; Value: 2.2uF; Order: *; Manuf_1: YAGEO; ECCN_US/EU: n/a
C79 C88 C93 C104 C105 = Cap_4.7uF_X5R_10%_0603: Capacitor,4.7uF,16V, X5R,10%,0603,YAGEO; Manuf_Part_1: CC0603KRX5R7BB475; Order: CC0603KRX5R7BB105; Revision: July-2002: Re-released for DXP Platform.; Value: 4.7uF; Manuf_1: YAGEO; ECCN_US/EU: n/a
CN1 = RCA_SMD: RCA Phono Jack, Right Angle, SMD, Yellow; Manuf_Part_1: JBB0819100002; Manuf_1: Jiubaba
CN10 = PJ3028B-3_GR: Connector Jack Stereo 3.5mm, female SMT, Green (Line output); Manuf_1: qiaod; Manuf_Part_2: PJ30280-3_GR; ECCN_US/EU: n/a; Manuf_Part_1: PJ3028B-3_GR
CN11 = PJ3028B-3_BE: Connector Jack Stereo 3.5mm, female SMT, Blue (Line input); Manuf_1: qiaod; Manuf_Part_2: PJ30280-3_BE; ECCN_US/EU: n/a; Manuf_Part_1: PJ3028B-3_BE
JP3 JP4 = Jumper2: Fitted: NO; ECCN_US/EU: n/a
R6 = Res_75_1%_0402: Resistor,75,0402,1%,YAGEO; Manuf_Part_1: RC0402FR-0775RL; Order: 311-75.0LRTR-ND; Value: 75; Manuf_1: YAGEO; ECCN_US/EU: n/a; Distrib: DIGIKEY
R7 R10 = Res_100_1%_0402: Resistor,100,0402,1%,YAGEO; Manuf_Part_1: RC0402FR-07100RL; Order: 9239111; Value: 100; Manuf_1: YAGEO; ECCN_US/EU: n/a; Distrib: FARNELL
R8 R80 = Res_NA_0402: Resistor,[NA],0402; Fitted: NO; Value: [NA]; ECCN_US/EU: n/a
R9 R22 = Res_1M_1%_0402: Resistor,1M,0402,1%,YAGEO; Manuf_Part_1: RC0402FR-071ML; Value: 1M; Manuf_1: YAGEO; Order: RC0402FR-071ML; ECCN_US/EU: n/a
R47 R87 = Res_10K_1%_0402: as R60 on sheet ST_LINK_V2-1; Value: 10K; Manuf_1: YAGEO; Order: RC0402FR-0710KL; ECCN_US/EU: n/a
R76 R83 = Res_0_5%_0402: Resistor,0,0402,5%,YAGEO; Manuf_Part_1: RC0402JR-070RL; Order: 2363467; Value: 0; ECCN_US/EU: n/a; Manuf_1: YAGEO; Distrib: FARNELL
R102 R121 = Res_20_1%_0402: Resistor,20,0402,1%,YAGEO; Manuf_Part_1: RC0402FR-0720RL; Value: 20; Manuf_1: YAGEO; Order: *; ECCN_US/EU: n/a
TP3 = TP1: Test Point; Fitted: NO; ECCN_US/EU: n/a
U1 U2 = 74LVC1G04SE: Single inverter gate with a standard push-pull output. (1.65V to 5.5V); Manuf_Part_1: 74LVC1G04SE-7; Manuf_1: DIODES; Order: 1845218; ECCN_US/EU: EAR99/NEC; Distrib: FARNELL
U11 = WM8994ECS/R: Multi-Channel Audio Hub CODEC for Smartphones; Manuf_1: Cirrus Logic; ECCN_US/EU: EAR99/NEC; Manuf_Part_1: WM8994ECS/R; Distrib: Cirrus Logic
U20 U21 = IMP34DT05TR: MEMS audio sensor omnidirectional digital microphone for industrial applications; Manuf_1: STMICROELECTRONICS; ECCN_US/EU: EAR99/NEC; provided: SUBCO with ST control; Manuf_Part_1: IMP34DT05TR; value: IMP34DT05TR

## Sheet USB_OTG_FS.SchDoc: USB OTG FS with Micro A-B connector
size A4; Date: 25-FEB-2015; Author: A.B; CompanyName: STMicroelectronics; Address1: 12, Rue Jules HOROWITZ; Address2: 38019 Grenoble; Address3: FRANCE; DocumentNumber: MB1191; Revision: B-02; SheetNumber: 9; SheetTotal: 14; Project: STM32F746G-DISCO
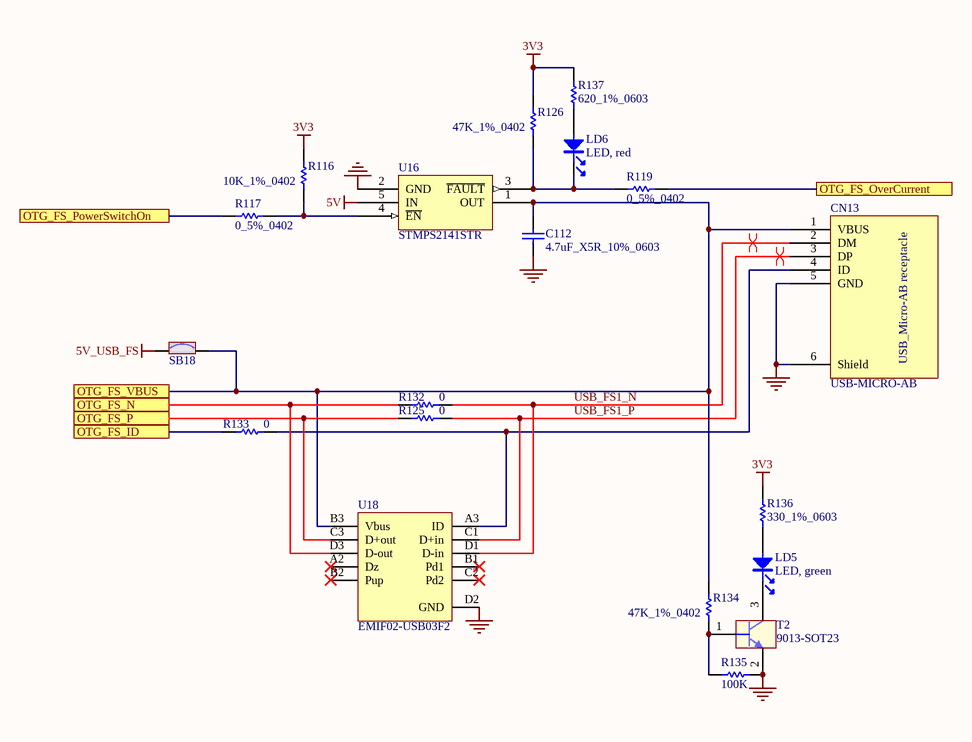
[diagram p4: USB_OTG_FS.SchDoc]

### Parts
C112  4.7uF_X5R_10%_0603  [0603C]
CN13  USB-MICRO-AB  [USB-MICRO-AB]
LD5  LED, green  [0603D]
LD6  LED, red  [0603D]
R116  10K_1%_0402  [0402R]
R117  0_5%_0402  [0402R]
R119  0_5%_0402  [0402R]
R125  0  [0402R]
R126  47K_1%_0402  [0402R]
R132  0  [0402R]
R133  0  [0402R]
R134  47K_1%_0402  [0402R]
R135  100K  [0402R]
R136  330_1%_0603  [0603R]
R137  620_1%_0603  [0603R]
SB18  Solder Bridge ON  [JP2_SMD]  (value not drawn)
T2  9013-SOT23  [SOT23]
U16  STMPS2141STR  [SOT23-5L]
U18  EMIF02-USB03F2  [Flip Chip]

### Ports
OTG_FS_ID, OTG_FS_N, OTG_FS_OverCurrent, OTG_FS_P, OTG_FS_PowerSwitchOn, OTG_FS_VBUS

### Nets
3V3: R116.2 R126.2 R136.2 R137.2
5V: U16.5(IN)
5V_USB_FS: SB18.1
GND: C112.1 CN13.5(GND) CN13.6(Shield) R135.2 T2.2(E) U16.2(GND) U18.D2(GND)
OTG_FS_ID: R133.1 ; port OTG_FS_ID
OTG_FS_N: R132.1 U18.D3(D-out) ; port OTG_FS_N
OTG_FS_OverCurrent: R119.2 ; port OTG_FS_OverCurrent
OTG_FS_P: R125.1 U18.C3(D+out) ; port OTG_FS_P
OTG_FS_PowerSwitchOn: R117.1 ; port OTG_FS_PowerSwitchOn
OTG_FS_VBUS: C112.2 CN13.1(VBUS) R134.2 SB18.2 U16.1(OUT) U18.B3(Vbus) ; port OTG_FS_VBUS
USB_FS1_N: CN13.2(DM) R132.2 U18.D1(D-in)
USB_FS1_P: CN13.3(DP) R125.2 U18.C1(D+in)
NetCN13_4: CN13.4(ID) R133.2 U18.A3(ID)
NetLD5_1: LD5.1 R136.1
NetLD5_2: LD5.2 T2.3(C)
NetLD6_1: LD6.1 R137.1
NetLD6_2: LD6.2 R119.1 R126.1 U16.3(~{FAULT})
NetR116_1: R116.1 R117.2 U16.4(~{EN})
NetR134_1: R134.1 R135.1 T2.1(B)

Not connected (* = marked no-connect by the designer): U18 A2(Dz)* B1(Pd1)* B2(Pup)* C2(Pd2)*

### Layout directives
differential pair: USB_FS1_N, USB_FS1_P

### Notes on the sheet
- Title:
- Project:
- Size:
- Revision:
- Variant:
- A4
- -
- Date:
- Reference:
- Sheet:
- of
- (in symbol USB-MICRO-AB) USB_Micro-AB receptacle

### Library data of the parts
C112 = Cap_4.7uF_X5R_10%_0603: as C79 on sheet AUDIO; Revision: July-2002: Re-released for DXP Platform.; Value: 4.7uF; Manuf_1: YAGEO; ECCN_US/EU: n/a
CN13 = USB-MICRO-AB: USB-MICRO-AB, 47590-0001, SMT, MOLEX; Ref St: xxxxxxx; Manuf_1: MOLEX; Manuf_Part_1: 47590-0001; ECCN_US/EU: n/a; Distrib: *
LD5 = LED_green: LED, green, 0603; Manuf_1: everlight; Manuf_Part_1: 19-213SYGC/S530-E2/TR8; ECCN_US/EU: EAR99/NEC; Order: 19-213SYGC/S530-E2/TR8
LD6 = LED_red: as LD2 on sheet ST_LINK_V2-1; Order: 19-217/R6C-AL1M2VY/3T
R116 = Res_10K_1%_0402: as R60 on sheet ST_LINK_V2-1; Value: 10K; Manuf_1: YAGEO; Order: RC0402FR-0710KL; ECCN_US/EU: n/a
R117 R119 = Res_0_5%_0402: Resistor,0,0402,5%,YAGEO; Manuf_Part_1: RC0402JR-070RL; Value: 0; Order: 2363467; ECCN_US/EU: n/a; Manuf_1: YAGEO; Distrib: FARNELL
R125 R132 R133 = Res_0_5%_0402: as R76 on sheet AUDIO; Value: 0; ECCN_US/EU: n/a; Manuf_1: YAGEO; Distrib: FARNELL
R126 R134 = Res_47K_1%_0402: Resistor,47K,0402,1%,YAGEO; Manuf_Part_1: RC0402FR-0747KL; Order: 9239430; Value: 47K; Manuf_1: YAGEO; ECCN_US/EU: n/a; Distrib: FARNELL
R135 = Res_100K_1%_0402: as R72 on sheet ST_LINK_V2-1; Value: 100K; Manuf_1: YAGEO; Order: RT0402FRE07100KL; ECCN_US/EU: n/a
R136 = Res_330_1%_0603: Resistor,330,0603,1%,YAGEO; Manuf_Part_1: RT0603FRE07330RL; Value: 330; Order: 1500622RL; ECCN_US/EU: n/a; Manuf_1: YAGEO; Distrib: FARNELL
R137 = Res_620_1%_0603: Resistor,620,0603,1%,VISHAY; Manuf_Part_1: CRCW0603620RFKEA; Manuf_1: VISHAY DRALORIC; Value: 620; Order: 2122341; ECCN_US/EU: n/a; Distrib: FARNELL
SB18 = SB_ON: Solder: YES; Revision: July-2002: Re-released for DXP Platform.; ECCN_US/EU: n/a
T2 = 9013-SOT23: as T3 on sheet ST_LINK_V2-1; Revision: July-2002: Re-released for DXP Platform.; Distrib: FARNELL
U16 = STMPS2141STR: Enhanced single channel power switches; Manuf_1: STM; Provided: ST; ECCN_US/EU: EAR99/NEC; Ref St: 9159003; Order: STMPS2141STR; Manuf_Part_1: STMPS2141STR; Distrib: ST
U18 = EMIF02-USB03F2: 2-line IPAD, EMI filter including ESD protection; Manuf_1: STM; Provided: ST; ECCN_US/EU: EAR99/NEC; Ref St: 9179037; Order: EMIF02-USB03F2; Manuf_Part_1: EMIF02-USB03F2; Distrib: ST

## Sheet Peripherals.SchDoc: Joystick, ACP, LEDs and Push Button
size A4; Date: 25-FEB-2015; Author: A.B; CompanyName: STMicroelectronics; Address1: 12, Rue Jules HOROWITZ; Address2: 38019 Grenoble; Address3: FRANCE; DocumentNumber: MB1191; Revision: B-02; SheetNumber: 5; SheetTotal: 14; Project: STM32F746G-DISCO
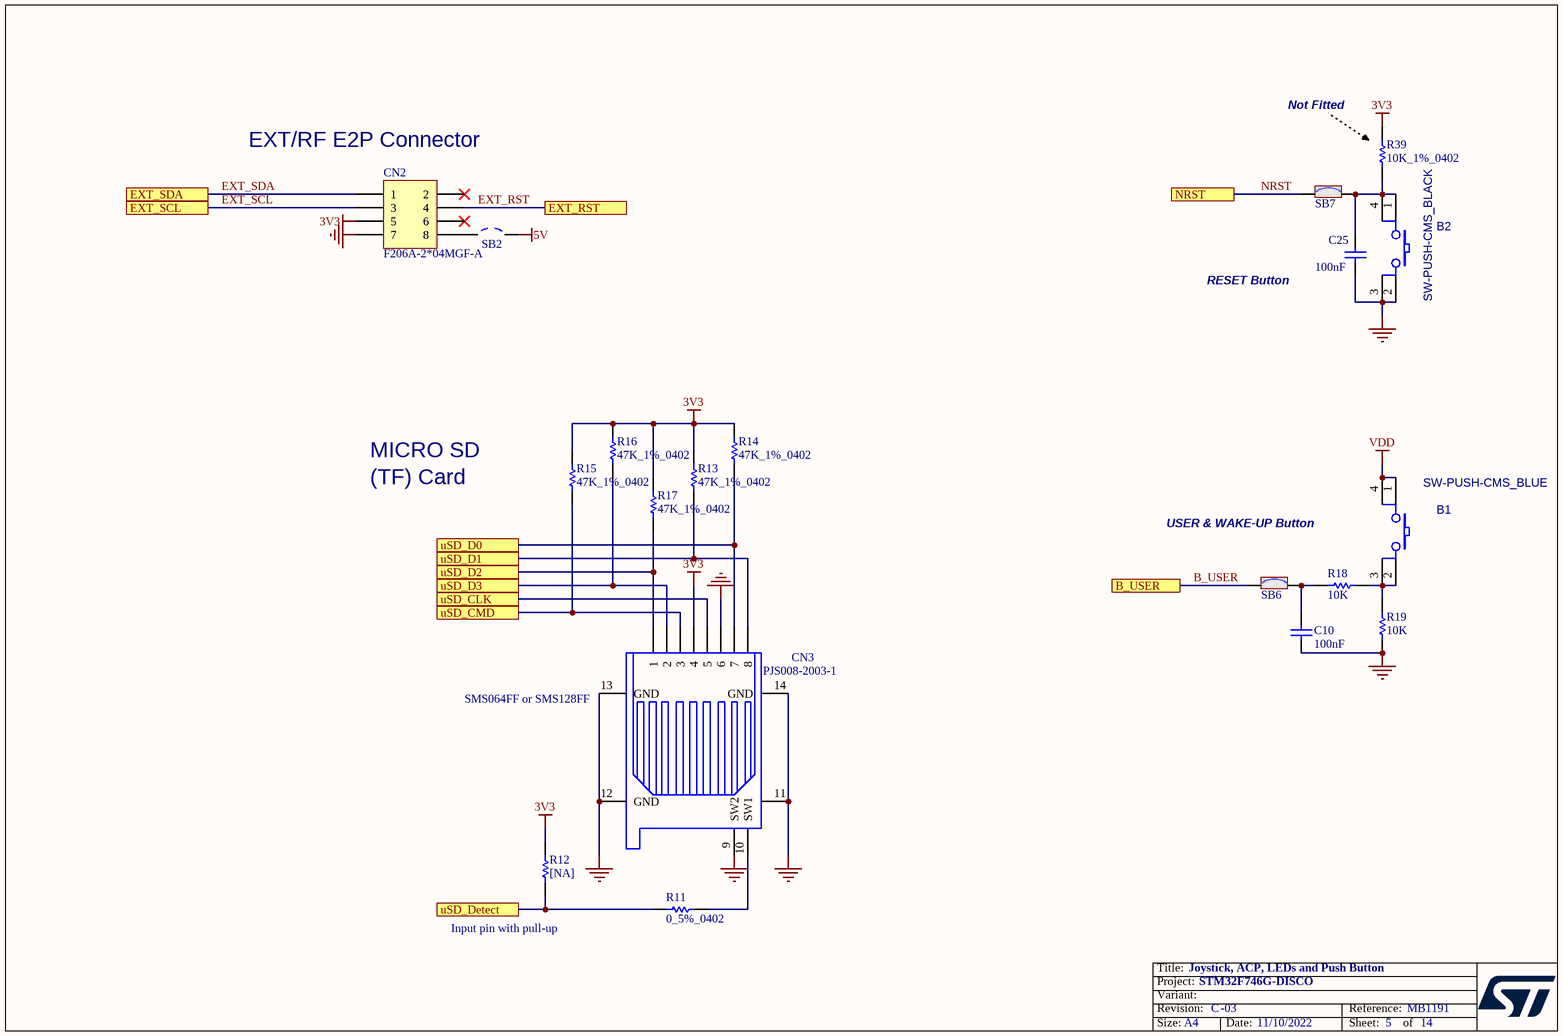
[diagram p5: Peripherals.SchDoc]

### Parts
B1  SW-PUSH-CMS_BLUE  [BP1CMS]
B2  SW-PUSH-CMS_BLACK  [BP1CMS]
C10  100nF  [0402C]
C25  100nF  [0402C]
CN2  F206A-2*04MGF-A  [SSM-104-L-DH]
CN3  PJS008-2003-1  [PJS008-2003-1]
R11  0_5%_0402  [0402R]
R12  [NA]  [0402R]
R13  47K_1%_0402  [0402R]
R14  47K_1%_0402  [0402R]
R15  47K_1%_0402  [0402R]
R16  47K_1%_0402  [0402R]
R17  47K_1%_0402  [0402R]
R18  10K  [0402R]
R19  10K  [0402R]
R39  10K_1%_0402  [0402R]
SB2  Solder Bridge OFF  [JP2_SMD]  (value not drawn)
SB6  Solder Bridge ON  [JP2_SMD]  (value not drawn)
SB7  Solder Bridge ON  [JP2_SMD]  (value not drawn)

### Ports
B_USER, EXT_RST, EXT_SCL, EXT_SDA, NRST, uSD_CLK, uSD_CMD, uSD_D0, uSD_D1, uSD_D2, uSD_D3, uSD_Detect

### Nets
3V3: CN2.5 CN3.4 R12.2 R13.2 R14.2 R15.2 R16.2 R17.2 R39.2
5V: SB2.2
GND: B2.2 B2.3 C10.1 C25.1 CN2.7 CN3.6 CN3.9(SW2) CN3.11(GND) CN3.12(GND) CN3.13(GND) CN3.14(GND) R19.1
VDD: B1.1 B1.4
B_USER: SB6.1 ; port B_USER
EXT_RST: CN2.4 ; port EXT_RST
EXT_SCL: CN2.3 ; port EXT_SCL  [project net ARD_D15]
EXT_SDA: CN2.1 ; port EXT_SDA  [project net ARD_D14]
NRST: SB7.1 ; port NRST  [project net DCMI_NRST]
PC8: CN3.7 R14.1 ; port uSD_D0
PC9: CN3.8 R13.1 ; port uSD_D1
PC10: CN3.1 R17.1 ; port uSD_D2
PC11: CN3.2 R16.1 ; port uSD_D3
PC12: CN3.5 ; port uSD_CLK
PC13: R11.1 R12.1 ; port uSD_Detect
PD2: CN3.3 R15.1 ; port uSD_CMD
NetB1_2: B1.2 B1.3 R18.2 R19.2
NetB2_1: B2.1 B2.4 C25.2 R39.1 SB7.2
NetC10_2: C10.2 R18.1 SB6.2
NetCN2_8: CN2.8 SB2.1
NetCN3_10: CN3.10(SW1) R11.2

Not connected (* = marked no-connect by the designer): CN2 2* 6*

### Notes on the sheet
- (near R39) Not Fitted
- (near CN2) EXT/RF E2P Connector
- RESET Button
- MICRO SD
- (TF) Card
- USER & WAKE-UP Button
- (near CN3) SMS064FF or SMS128FF
- (near R12) Input pin with pull-up
- Title:
- Project:
- Size:
- Revision:
- Variant:
- A4
- -
- Date:
- Reference:
- Sheet:
- of

### Library data of the parts
B1 = SW-PUSH-CMS_BLUE: Non-Open Push-Button 0.1A 24V; Manuf_2: FARNELL; Manuf_Part_2: 535-930; Manuf_1: wealthmetal; Manuf_Part_1: TD0341X-G01-BLU; Ref St: 9180120; Distrib: JFVNY; ECCN_US/EU: n/a
B2 = SW-PUSH-CMS_BLACK: Non-Open Push-Button 0.1A 24V; Manuf_2: FARNELL; Manuf_Part_2: 535-930; Manuf_1: wealthmetal; Manuf_Part_1: TD0341X-G01-BLA; Ref St: 9180120; Distrib: JFVNY; ECCN_US/EU: n/a
C10 C25 = Cap_100nF_X7R_10%_0402: as C61 on sheet ST_LINK_V2-1; Revision: July-2002: Re-released for DXP Platform.; Value: 100nF; Order: CC0402KRX7R7BB104; Manuf_1: YAGEO
CN2 = F206A-2*04MGF-A: Header, 5-Pins, Horizontal Dual row, female SMD; Manuf_2: SAMTEC; Manuf_1: TOWNES; Revision: 17-Jul-2002: Re-released for DXP Platform.; Manuf_Part_2: SSM-104-L-DH; ECCN_US/EU: n/a; Manuf_Part_1: F206A-2*04MGF-A
CN3 = microSD-PJS008-2003: Memory Card Connectors MicroSD Card Conn Revrs Mnt Push-Push; Manuf_1: YAMAICHI; Manuf_Part_1: PJS008-2003-1; ECCN_US/EU: N/A; Order: PJS008-2003-1
R11 = Res_0_5%_0402: as R117 on sheet USB_OTG_FS; ECCN_US/EU: n/a; Manuf_1: YAGEO; Distrib: FARNELL
R12 = Res_NA_0402: Resistor,[NA],0402; Fitted: NO; Value: [NA]; ECCN_US/EU: n/a
R13-R17 = Res_47K_1%_0402: as R126 on sheet USB_OTG_FS; Value: 47K; Manuf_1: YAGEO; ECCN_US/EU: n/a; Distrib: FARNELL
R18 R19 = Res_10K_1%_0402: as R60 on sheet ST_LINK_V2-1; Value: 10K; Manuf_1: YAGEO; Order: RC0402FR-0710KL; ECCN_US/EU: n/a
R39 = Res_10K_1%_0402: Resistor,10K,0402,1%,YAGEO; Manuf_Part_1: RC0402FR-0710KL; Fitted: NO; Value: 10K; Manuf_1: YAGEO; Order: RC0402FR-0710KL; ECCN_US/EU: n/a
SB2 = SB_OFF: Solder: NO; Revision: July-2002: Re-released for DXP Platform.; ECCN_US/EU: n/a
SB6 SB7 = SB_ON: Solder: YES; Revision: July-2002: Re-released for DXP Platform.; ECCN_US/EU: n/a

## Sheet QSPI.SchDoc: Quad SPI Flash Memory (MICRON)
size A4; Date: 25-FEB-2015; Author: A.B; CompanyName: STMicroelectronics; Address1: 12, Rue Jules HOROWITZ; Address2: 38019 Grenoble; Address3: FRANCE; DocumentNumber: MB1191; Revision: B-02; SheetNumber: 7; SheetTotal: 14; Project: STM32F746G-DISCO
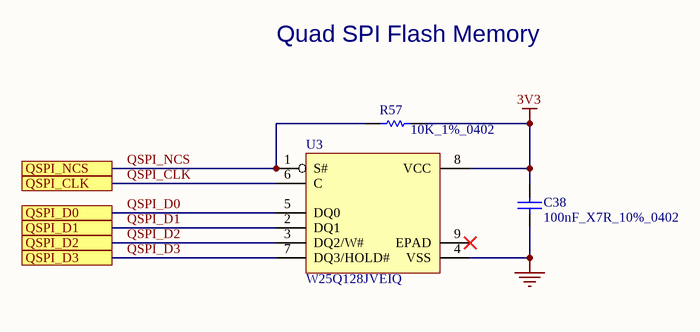
[diagram p6: QSPI.SchDoc]

### Parts
C38  100nF_X7R_10%_0402  [0402C]
R57  10K_1%_0402  [0402R]
U3  W25Q128JVEIQ  [W-PDFN-8_8X6_P127]

### Ports
QSPI_CLK, QSPI_D0, QSPI_D1, QSPI_D2, QSPI_D3, QSPI_NCS

### Nets
3V3: C38.2 R57.2 U3.8(VCC)
GND: C38.1 U3.4(VSS)
QSPI_CLK: U3.6(C) ; port QSPI_CLK  [project net PB2]
QSPI_D0: U3.5(DQ0) ; port QSPI_D0  [project net PD11]
QSPI_D1: U3.2(DQ1) ; port QSPI_D1  [project net PD12]
QSPI_D2: U3.3(DQ2/W#) ; port QSPI_D2  [project net PE2]
QSPI_D3: U3.7(DQ3/HOLD#) ; port QSPI_D3  [project net PD13]
QSPI_NCS: R57.1 U3.1(S#) ; port QSPI_NCS  [project net PB6]

Not connected (* = marked no-connect by the designer): U3 9(EPAD)*

### Notes on the sheet
- Quad SPI Flash Memory
- Title:
- Project:
- Size:
- Revision:
- Variant:
- A4
- -
- Date:
- Reference:
- Sheet:
- of

### Library data of the parts
C38 = Cap_100nF_X7R_10%_0402: as C61 on sheet ST_LINK_V2-1; Revision: July-2002: Re-released for DXP Platform.; Value: 100nF; Order: CC0402KRX7R7BB104; Manuf_1: YAGEO; ECCN_US/EU: n/a
R57 = Res_10K_1%_0402: as R60 on sheet ST_LINK_V2-1; Value: 10K; Manuf_1: YAGEO; Order: RC0402FR-0710KL; ECCN_US/EU: n/a
U3 = MT25QL128ABA1EW9-0SIT: 128Mb, 3V, Multiple I/O Serial Flash Memory, Quad/Dual; Manuf_1: Winbond; ECCN_US/EU: 3A991/NEC; Provided: ST; Manuf_Part_1: W25Q128JVEIQ; Value: W25Q128JVEIQ

## Sheet LCD-43.SchDoc: LCD 4.3" with Capacitive Touch
size A4; Date: 25-FEB-2015; Author: A.B; CompanyName: STMicroelectronics; Address1: 12, Rue Jules HOROWITZ; Address2: 38019 Grenoble; Address3: FRANCE; DocumentNumber: MB1191; Revision: B-02; SheetNumber: 14; SheetTotal: 14; Project: STM32F746G-DISCO
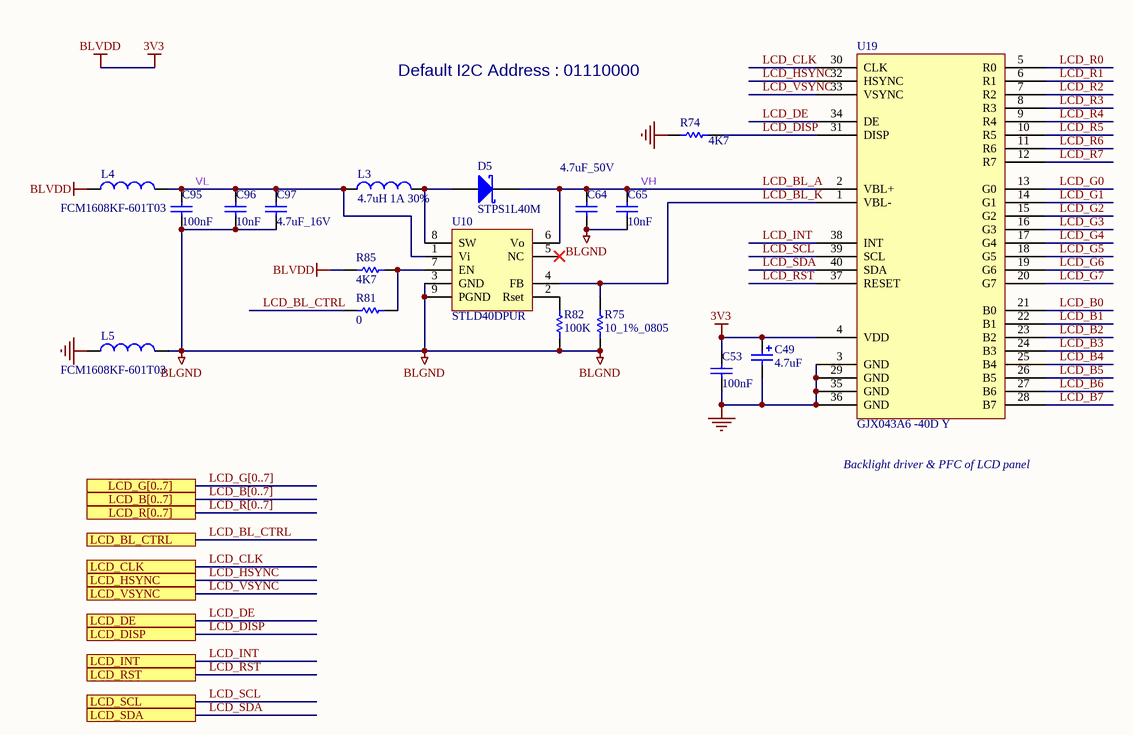
[diagram p7: LCD-43.SchDoc]

### Parts
C49  4.7uF  [TAN-A]
C53  100nF  [0402C]
C64  4.7uF_50V  [1206C]
C65  10nF  [0603C]
C95  100nF  [0603C]
C96  10nF  [0603C]
C97  4.7uF_16V  [1206C]
D5  STPS1L40M  [DO216-AA]
L3  4.7uH 1A 30%  [1210L]
L4  FCM1608KF-601T03  [0603L]
L5  FCM1608KF-601T03  [0603L]
R74  4K7  [0402R]
R75  10_1%_0805  [0805R]
R81  0  [0402R]
R82  100K  [0402R]
R85  4K7  [0402R]
U10  STLD40DPUR  [QFN8_0R65_3X3_ST]
U19  GJX043A6 -40D Y  [LCD_Kunjian_ HT043C_40P_P080_FLEX_FOLDED]

### Ports
LCD_B[0..7], LCD_BL_CTRL, LCD_CLK, LCD_DE, LCD_DISP, LCD_G[0..7], LCD_HSYNC, LCD_INT, LCD_R[0..7], LCD_RST, LCD_SCL, LCD_SDA, LCD_VSYNC

### Nets
3V3: C49.1 C53.2 L4.1 R85.2 U19.4(VDD)  [also labelled BLVDD]
BLGND: C64.2 C65.1 C95.1 C96.1 C97.2 L5.2 R75.1 R82.2 U10.3(GND) U10.9(PGND)
GND: C49.2 C53.1 L5.1 R74.2 U19.3(GND) U19.29(GND) U19.35(GND) U19.36(GND)
LCD_B0: U19.21(B0)
LCD_B1: U19.22(B1)
LCD_B2: U19.23(B2)
LCD_B3: U19.24(B3)
LCD_B4: U19.25(B4)
LCD_B5: U19.26(B5)
LCD_B6: U19.27(B6)
LCD_B7: U19.28(B7)
LCD_BL_A: C64.1 C65.2 D5.2(K) U10.6(Vo) U19.2(VBL+)  [also labelled VH]
LCD_BL_CTRL: R81.2 ; port LCD_BL_CTRL
LCD_BL_K: R75.2 U10.4(FB) U19.1(VBL-)
LCD_CLK: U19.30(CLK) ; port LCD_CLK
LCD_DE: U19.34(DE) ; port LCD_DE
LCD_DISP: R74.1 U19.31(DISP) ; port LCD_DISP
LCD_G0: U19.13(G0)
LCD_G1: U19.14(G1)
LCD_G2: U19.15(G2)
LCD_G3: U19.16(G3)
LCD_G4: U19.17(G4)
LCD_G5: U19.18(G5)
LCD_G6: U19.19(G6)
LCD_G7: U19.20(G7)
LCD_HSYNC: U19.32(HSYNC) ; port LCD_HSYNC
LCD_INT: U19.38(INT) ; port LCD_INT
LCD_R0: U19.5(R0)
LCD_R1: U19.6(R1)
LCD_R2: U19.7(R2)
LCD_R3: U19.8(R3)
LCD_R4: U19.9(R4)
LCD_R5: U19.10(R5)
LCD_R6: U19.11(R6)
LCD_R7: U19.12(R7)
LCD_RST: U19.37(RESET) ; port LCD_RST  [project net DCMI_NRST]
LCD_SCL: U19.39(SCL) ; port LCD_SCL  [project net AUDIO_SCL]
LCD_SDA: U19.40(SDA) ; port LCD_SDA  [project net AUDIO_SDA]
LCD_VSYNC: U19.33(VSYNC) ; port LCD_VSYNC
VL: C95.2 C96.2 C97.1 L3.1 L4.2 U10.1(Vi)
NetD5_1: D5.1(A) L3.2 U10.8(SW)
NetR81_1: R81.1 R85.1 U10.7(EN)
NetR82_1: R82.1 U10.2(Rset)

Not connected (* = marked no-connect by the designer): U10 5(NC)*

### Buses and harness runs
bus LCD_B[0..7] = port LCD_B[0..7]
bus LCD_G[0..7] = port LCD_G[0..7]
bus LCD_R[0..7] = port LCD_R[0..7]

### Notes on the sheet
- Default I2C Address : 01110000
- Backlight driver & PFC of LCD panel
- Title:
- Project:
- Size:
- Revision:
- Variant:
- A4
- -
- Date:
- Reference:
- Sheet:
- of

### Library data of the parts
C49 = Cap_4.7uF_POL_10%_TANA: Polarized Capacitor,4.7uF,16V,10%,typeA,AVX; Manuf_Part_1: TAJA475K016R; Revision: July-2002: Re-released for DXP Platform.; Value: 4.7uF; Manuf_1: AVX; Order: TAJA475K016R; ECCN_US/EU: n/a
C53 = Cap_100nF_X7R_10%_0402: as C61 on sheet ST_LINK_V2-1; Revision: July-2002: Re-released for DXP Platform.; Value: 100nF; Order: CC0402KRX7R7BB104; Manuf_1: YAGEO; ECCN_US/EU: n/a
C64 = Cap_4.7uF_X7R_10%_1206: Capacitor,4.7uF,50V, X7R,10%,1206,AVX; Manuf_Part_1: 12065C475KAT2A; Revision: July-2002: Re-released for DXP Platform.; Value: 4.7uF; Order: *; Manuf_1: AVX; ECCN_US/EU: n/a; Distrib: FARNELL
C65 C96 = Cap_10nF_X7R_10%_0603: as C94 on sheet ST_LINK_V2-1; Revision: July-2002: Re-released for DXP Platform.; Value: 10nF; Order: CC0603KRX7R9BB103; Manuf_1: YAGEO; ECCN_US/EU: n/a
C95 = Cap_100nF_X7R_10%_0603: Capacitor,100nF,16V,X7R,10%,0603,YAGEO; Manuf_Part_1: CC0603KRX7R9BB104; Revision: July-2002: Re-released for DXP Platform.; Value: 100nF; Order: CC0603KRX7R9BB104; Manuf_1: YAGEO; ECCN_US/EU: n/a
C97 = Cap_4.7uF_X5R_10%_1206: Capacitor,4.7uF,16V, X5R,10%,1206,AVX; Manuf_Part_1: 1206YD475KAT2A; Revision: July-2002: Re-released for DXP Platform.; Value: 4.7uF; Order: *; Manuf_1: AVX; ECCN_US/EU: n/a; Distrib: FARNELL
D5 = STPS1L40M: Low Drop power Schottky rectifier(1A, 40V, 0.4V); Manuf_1: STM; Provided: ST; Ref St: 9151085; ECCN_US/EU: EAR99/NEC; Manuf_Part_1: STPS1L40M; Order: STPS1L40M; Distrib: ST; Code - JEDEC: *
L3 = Ind_4.7uH_1A_30%: FIXED IND 4.7UH 1A 180 MOHM 30% SMD; Manuf_Part_1: LQH32PN4R7NN0L; Manuf_1: MURATA; Order: 490-5338-1-ND; Distrib: DIGIKEY; ECCN_US/EU: n/a
L4 L5 = BEAD_600R_350MA_0603: Bead,600R,350mA,0603,FCM1608KF-601T03,Tai-tech; Manuf_2: TDK; Manuf_Part_2: MPZ1608S300A; Manuf_Part_3: BLM18PG121SN1D; Manuf_3: MURATA; Value: 100uH; Description_2: Bead,30R,5A,0603,MPZ1608S300A,TDK; Description_3: Bead,120R,2A,0603,BLM18PG121SN1D,MURATA; Revision: July-2002: Re-released for DXP Platform.; Manuf_Part_1: FCM1608KF-601T03; Manuf_1: Tai-tech; ECCN_US/EU: n/a
R74 R85 = Res_4K7_1%_0402: as R97 on sheet ST_LINK_V2-1; Value: 4K7; Manuf_1: YAGEO; Order: RT0402FRE074K7L; ECCN_US/EU: n/a
R75 = Res_10_1%_0805: Resistor,10,0805,1%,Stackpole,1/4W; Manuf_Part_1: RNCP0805FTD10R0; Manuf_1: Stackpole Electronics Inc; Value: 10; Order: RNCP0805FTD10R0; ECCN_US/EU: n/a
R81 = Res_0_5%_0402: as R76 on sheet AUDIO; Value: 0; ECCN_US/EU: n/a; Manuf_1: YAGEO; Distrib: FARNELL
R82 = Res_100K_1%_0402: as R72 on sheet ST_LINK_V2-1; Value: 100K; Manuf_1: YAGEO; Order: RT0402FRE07100KL; ECCN_US/EU: n/a
U10 = STLD40DPUR: White LED power supply for large display backlight, QFN8; Manuf_1: STM; ECCN_US/EU: EAR99/NEC; Ref St: xxxxxxxxx; Provided: ST; Order: STLD40DPUR; Manuf_Part_1: STLD40DPUR; Distrib: ST
U19 = HT043C: 4.3 inch TFT 480*272 pixels with LED Backlight and Capacitive touch panel, high luminance; Manuf_1: Shenzhen GJX Electronics Technology Co.,Ltd; ECCN_US/EU: EAR99/NEC; Manuf_Part_1: GJX043A6 -40D Y; Distrib: Sub Co; Ref St: *